# EAGLE design proudomodul3 (EAGLE 7.2.0)

## Sheet 1 of 4: Power supply
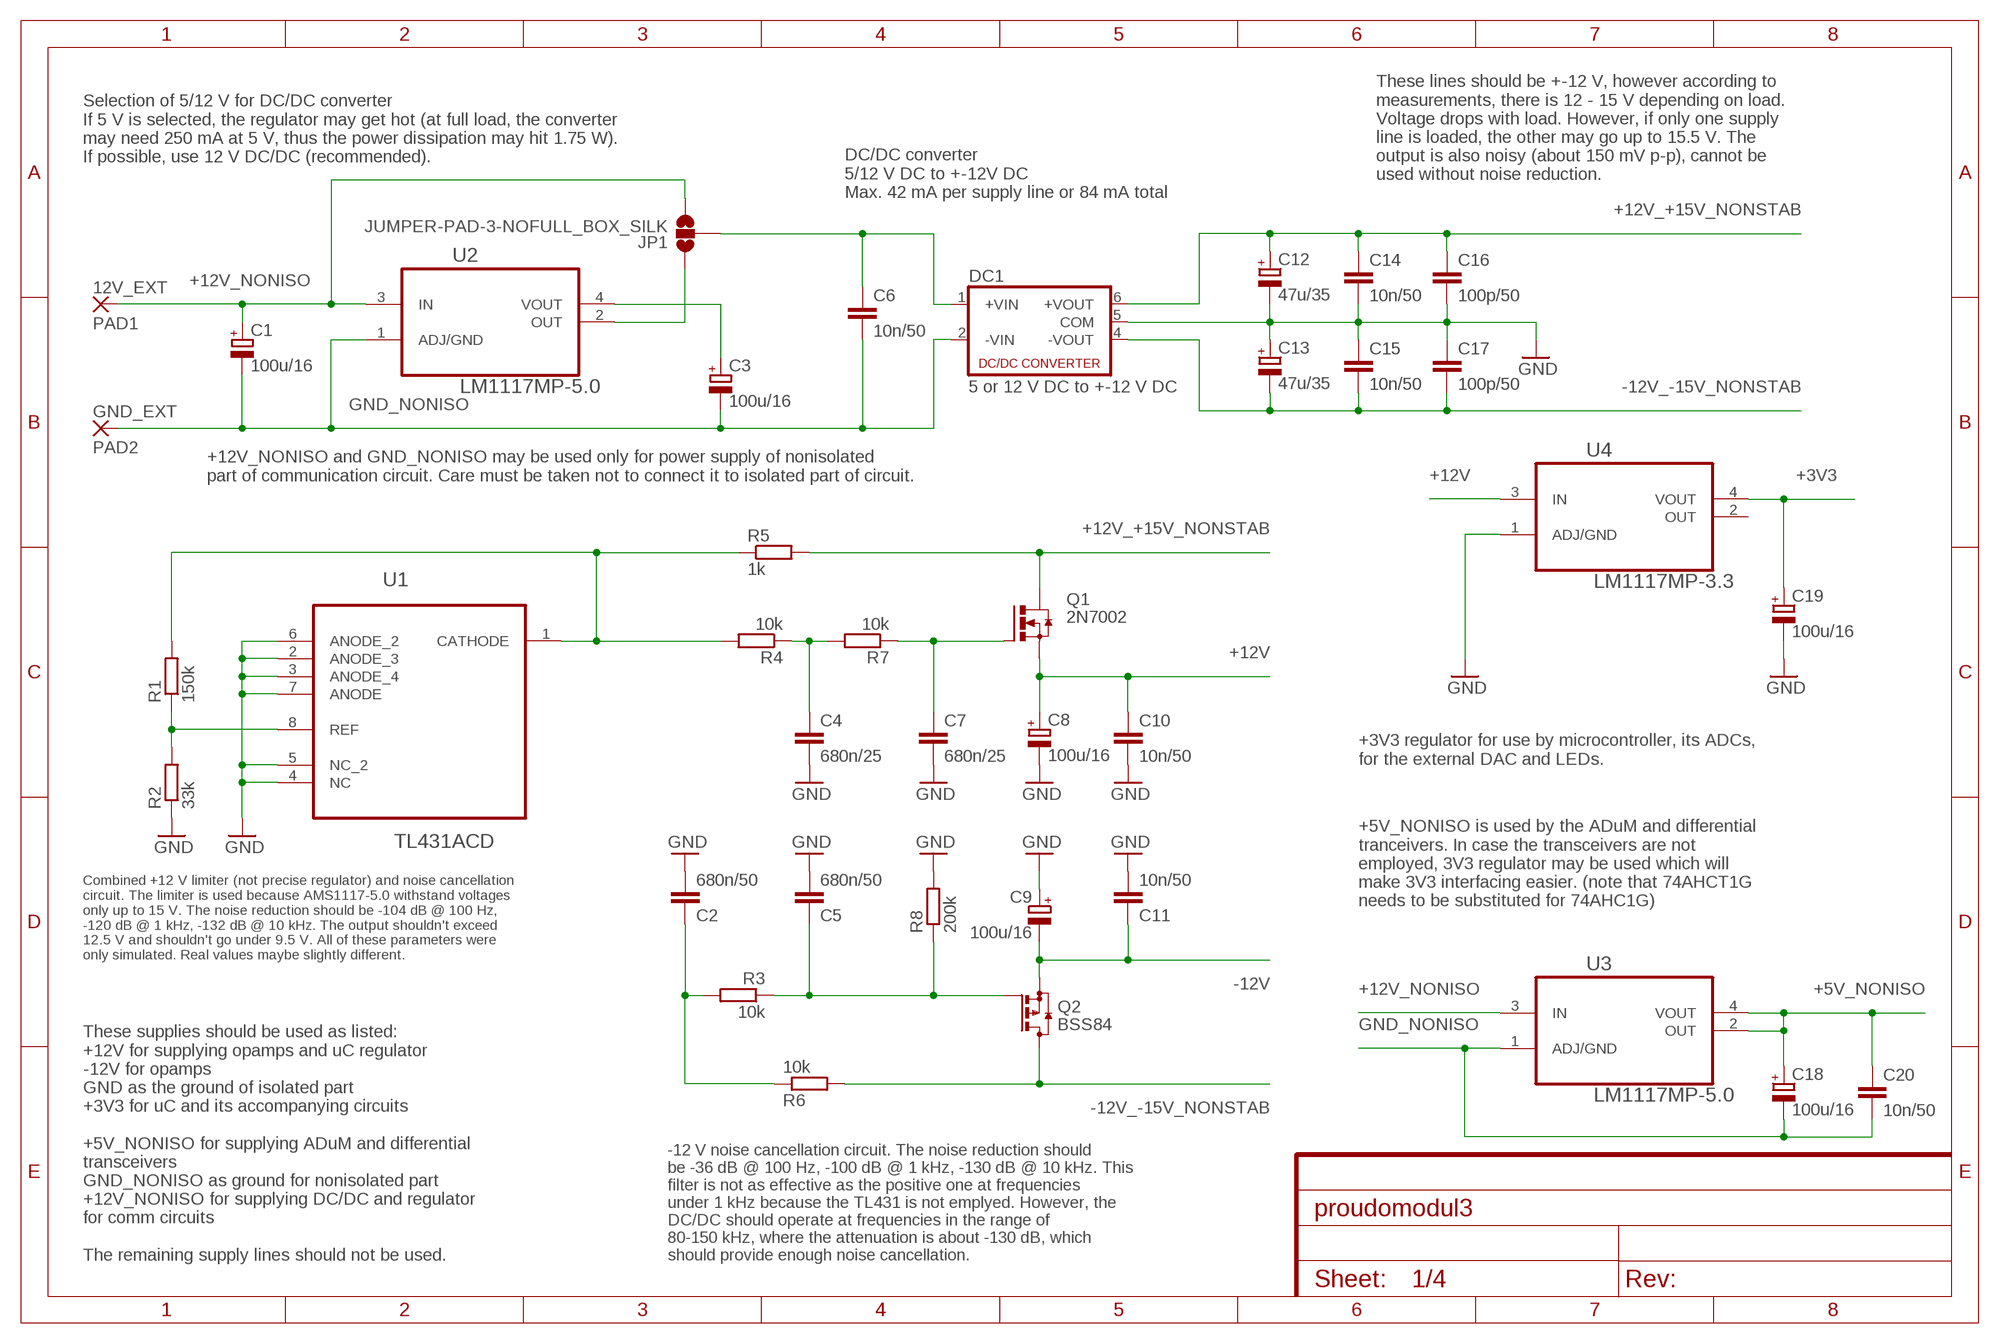
[diagram p0: schematic, sheet 1]
FRAME1 (FRAME-A4L): CNAME: Power supply; CREVISION: 107; DESIGNER: Petr Polasek

### Parts
C1  100u/16  CPOL-EU153CLV-0605  [153CLV-0605]
C2  680n/50  C-EUC0805  [C0805]
C3  100u/16  CPOL-EU153CLV-0605  [153CLV-0605]
C4  680n/25  C-EUC0805  [C0805]
C5  680n/50  C-EUC0805  [C0805]
C6  10n/50  C-EUC0805  [C0805]
C7  680n/25  C-EUC0805  [C0805]
C8  100u/16  CPOL-EU153CLV-0605  [153CLV-0605]
C9  100u/16  CPOL-EU153CLV-0605  [153CLV-0605]
C10  10n/50  C-EUC0805  [C0805]
C11  10n/50  C-EUC0805  [C0805]
C12  47u/35  CPOL-EU153CLV-0605  [153CLV-0605]
C13  47u/35  CPOL-EU153CLV-0605  [153CLV-0605]
C14  10n/50  C-EUC0805  [C0805]
C15  10n/50  C-EUC0805  [C0805]
C16  100p/50  C-EUC0805  [C0805]
C17  100p/50  C-EUC0805  [C0805]
C18  100u/16  CPOL-EU153CLV-0605  [153CLV-0605]
C19  100u/16  CPOL-EU153CLV-0605  [153CLV-0605]
C20  10n/50  C-EUC0805  [C0805]
DC1  5 or 12 V DC to +-12 V DC  NMA  [NMA]
JP1  JUMPER-PAD-3-NOFULL_BOX_SILK  [PAD-JUMPER-3-NO_YES_SILK_FULL_BOX]
PAD1  12V_EXT  2,15/1,0  [2,15/1,0]
PAD2  GND_EXT  2,15/1,0  [2,15/1,0]
Q1  2N7002  [SOT23-BEC]
Q2  BSS84  [SOT23]
R1  150k  R-EU_R0805  [R0805]
R2  33k  R-EU_R0805  [R0805]
R3  10k  R-EU_R0805  [R0805]
R4  10k  R-EU_R0805  [R0805]
R5  1k  R-EU_R0805  [R0805]
R6  10k  R-EU_R0805  [R0805]
R7  10k  R-EU_R0805  [R0805]
R8  200k  R-EU_R0805  [R0805]
U1  TL431ACD  [SOIC127P600X175-8N]
U2  LM1117MP-5.0  [SOT230P696X180-4N]
U3  LM1117MP-5.0  [SOT230P696X180-4N]
U4  LM1117MP-3.3  [SOT230P696X180-4N]

### Nets
+3V3: C19.+ U4.4(VOUT) ; also sheet 2,4
+5V_NONISO: C18.+ C20.1 U3.2(OUT) U3.4(VOUT) ; also sheet 2
+12V: C8.+ C10.1 Q1.E(S) U4.3(IN) ; also sheet 3,4
+12V_+15V_NONSTAB: C12.+ C14.1 C16.1 DC1.6(+VOUT) Q1.C(D) R5.2
+12V_NONISO: C1.+ JP1.3 PAD1.1(P) U2.3(IN) U3.3(IN) ; also sheet 2
-12V: C9.- C11.1 Q2.2(S) ; also sheet 3,4
-12V_-15V_NONSTAB: C13.- C15.2 C17.2 DC1.4(-VOUT) Q2.3(D) R6.2
GND: C2.2 C4.2 C5.2 C7.2 C8.- C9.+ C10.2 C11.2 C12.- C13.+ C14.2 C15.1 C16.2 C17.1 C19.- DC1.5(COM) R2.1 R8.2 U1.2(ANODE_3) U1.3(ANODE_4) U1.4(NC) U1.5(NC_2) U1.6(ANODE_2) U1.7(ANODE) U4.1(ADJ/GND) ; also sheet 2,3,4
GND_NONISO: C1.- C3.- C6.2 C18.- C20.2 DC1.2(-VIN) PAD2.1(P) U2.1(ADJ/GND) U3.1(ADJ/GND) ; also sheet 2
N$21: C4.1 R4.1 R7.2
N$26: C6.1 DC1.1(+VIN) JP1.2
N$27: R1.1 R2.2 U1.8(REF)
N$28: R1.2 R4.2 R5.1 U1.1(CATHODE)
N$29: C7.1 Q1.B(G) R7.1
N$30: C2.1 R3.2 R6.1
N$31: C5.1 Q2.1(G) R3.1 R8.1
N$45: JP1.1 U2.2(OUT)
N$47: C3.+ U2.4(VOUT)
Unconnected: U4.2(OUT)

### Notes on the sheet
- Selection of 5/12 V for DC/DC converter
  If 5 V is selected, the regulator may get hot (at full load, the converter
  may need 250 mA at 5 V, thus the power dissipation may hit 1.75 W).
  If possible, use 12 V DC/DC (recommended).
- These lines should be +-12 V, however according to
  measurements, there is 12 - 15 V depending on load.
  Voltage drops with load. However, if only one supply
  line is loaded, the other may go up to 15.5 V. The
  output is also noisy (about 150 mV p-p), cannot be
  used without noise reduction.
- DC/DC converter
  5/12 V DC to +-12V DC
  Max. 42 mA per supply line or 84 mA total
- +12V_NONISO and GND_NONISO may be used only for power supply of nonisolated
  part of communication circuit. Care must be taken not to connect it to isolated part of circuit.
- +3V3 regulator for use by microcontroller, its ADCs,
  for the external DAC and LEDs.
- +5V_NONISO is used by the ADuM and differential
  tranceivers. In case the transceivers are not
  employed, 3V3 regulator may be used which will
  make 3V3 interfacing easier. (note that 74AHCT1G
  needs to be substituted for 74AHC1G)
- Combined +12 V limiter (not precise regulator) and noise cancellation
  circuit. The limiter is used because AMS1117-5.0 withstand voltages
  only up to 15 V. The noise reduction should be -104 dB @ 100 Hz, 
  -120 dB @ 1 kHz, -132 dB @ 10 kHz. The output shouldn't exceed
  12.5 V and shouldn't go under 9.5 V. All of these parameters were
  only simulated. Real values maybe slightly different.
- These supplies should be used as listed:
  +12V for supplying opamps and uC regulator
  -12V for opamps
  GND as the ground of isolated part
  +3V3 for uC and its accompanying circuits
  
  +5V_NONISO for supplying ADuM and differential
  transceivers
  GND_NONISO as ground for nonisolated part
  +12V_NONISO for supplying DC/DC and regulator
  for comm circuits
  
  The remaining supply lines should not be used.
- -12 V noise cancellation circuit. The noise reduction should
  be -36 dB @ 100 Hz, -100 dB @ 1 kHz, -130 dB @ 10 kHz. This
  filter is not as effective as the positive one at frequencies
  under 1 kHz because the TL431 is not emplyed. However, the
  DC/DC should operate at frequencies in the range of
  80-150 kHz, where the attenuation is about -130 dB, which
  should provide enough noise cancellation.

## Sheet 2 of 4: Isolated comm circuits
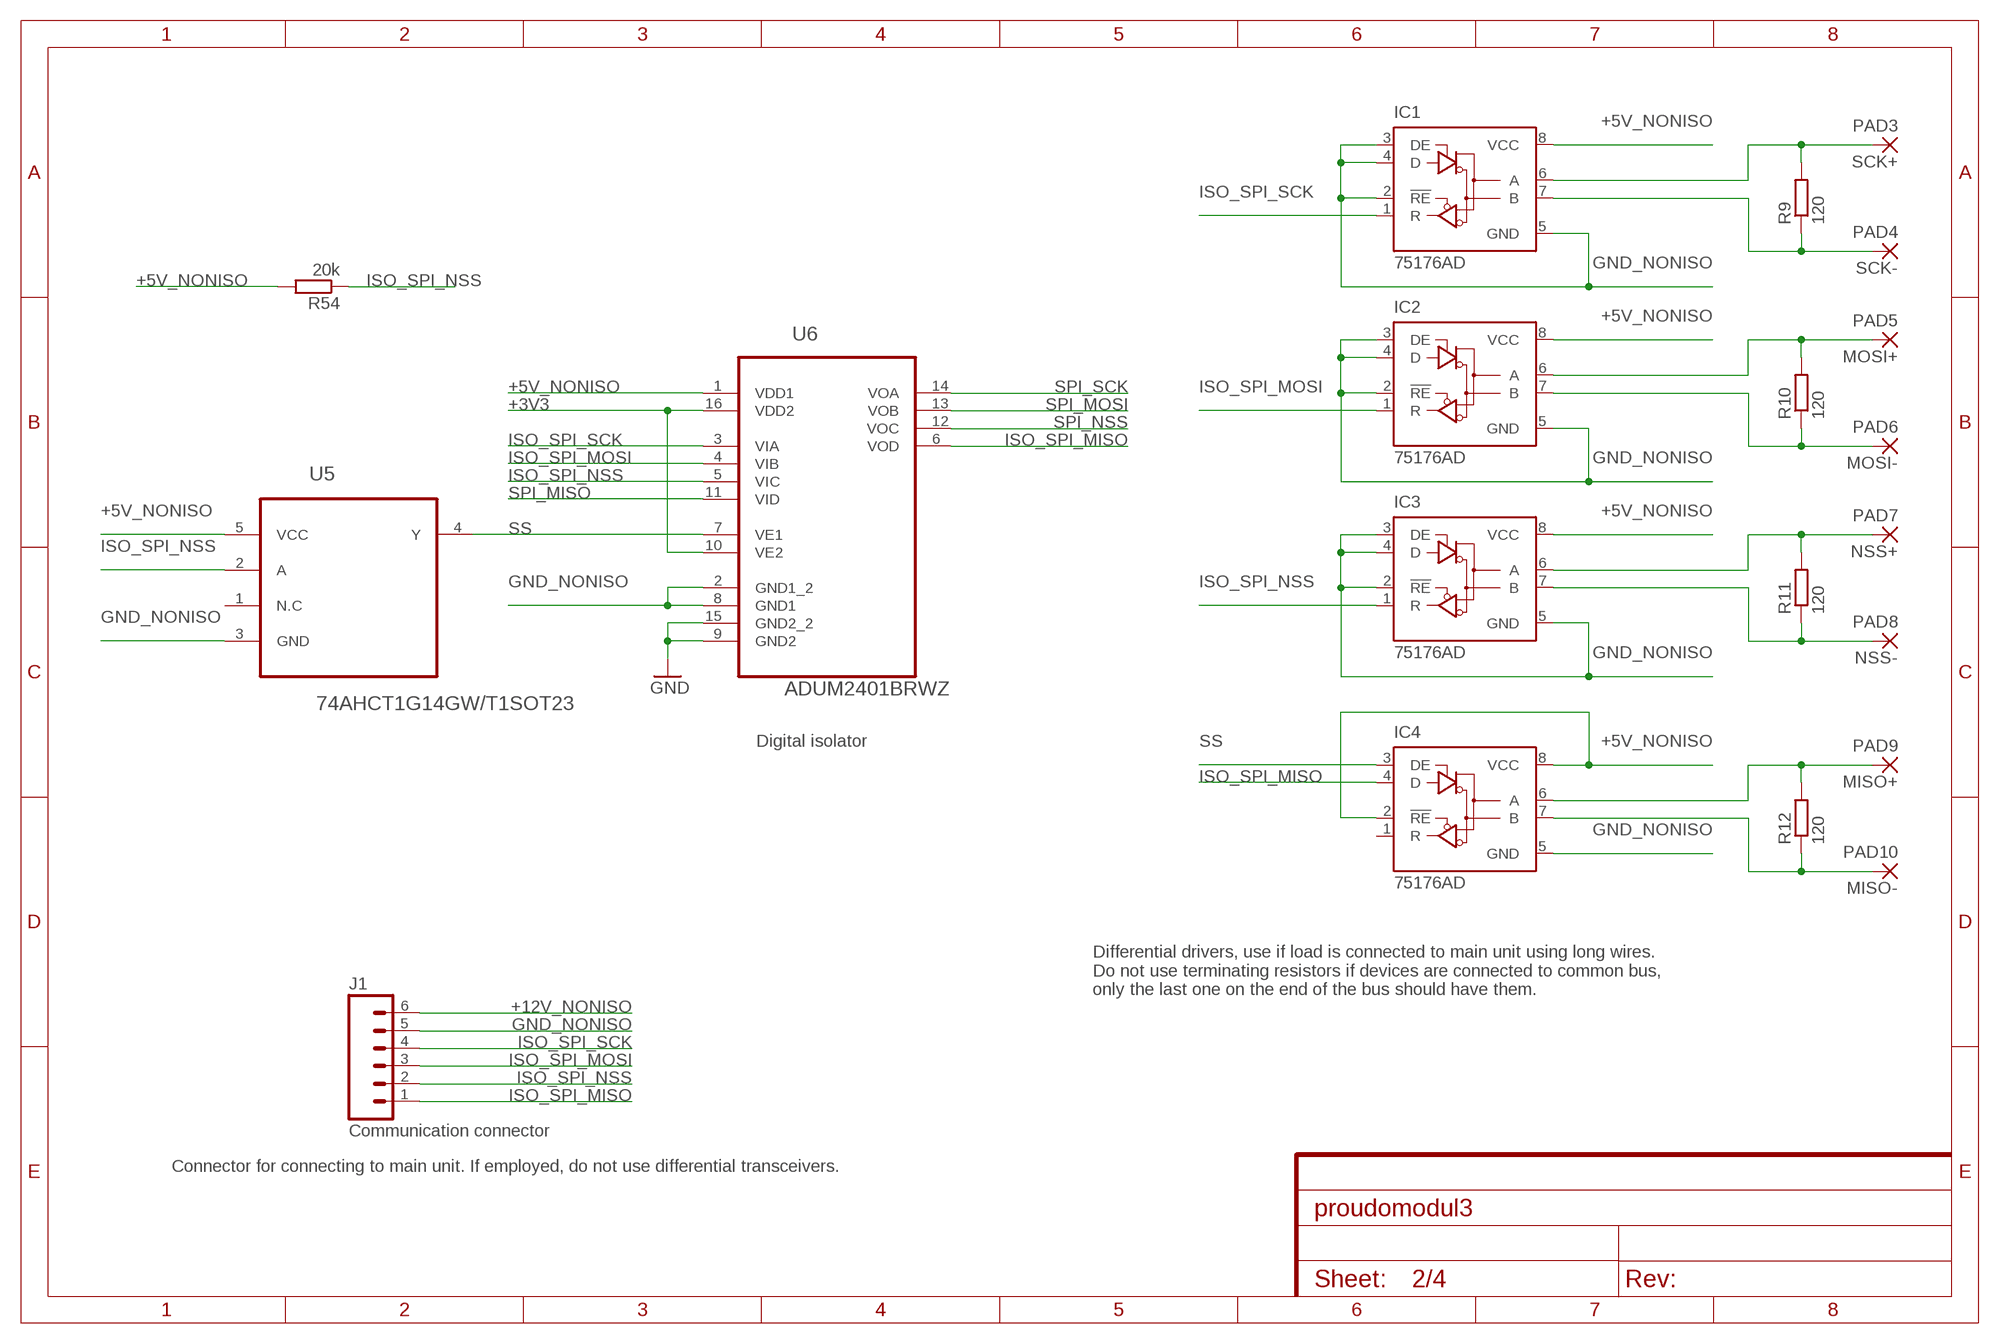
[diagram p1: schematic, sheet 2]
FRAME2 (FRAME-A4L): CNAME: Isolated comm circuits; CREVISION: 107; DESIGNER: Petr Polasek

### Parts
IC1  75176AD  [D_R-PDSO-G8]
IC2  75176AD  [D_R-PDSO-G8]
IC3  75176AD  [D_R-PDSO-G8]
IC4  75176AD  [D_R-PDSO-G8]
J1  Communication connector  M06RA_LOCK  [MOLEX-1X6-RA_LOCK]
PAD3  SCK+  2,15/1,0  [2,15/1,0]
PAD4  SCK-  2,15/1,0  [2,15/1,0]
PAD5  MOSI+  2,15/1,0  [2,15/1,0]
PAD6  MOSI-  2,15/1,0  [2,15/1,0]
PAD7  NSS+  2,15/1,0  [2,15/1,0]
PAD8  NSS-  2,15/1,0  [2,15/1,0]
PAD9  MISO+  2,15/1,0  [2,15/1,0]
PAD10  MISO-  2,15/1,0  [2,15/1,0]
R9  120  R-EU_R0805  [R0805]
R10  120  R-EU_R0805  [R0805]
R11  120  R-EU_R0805  [R0805]
R12  120  R-EU_R0805  [R0805]
R54  20k  R-EU_R0805  [R0805]
U5  74AHCT1G14GW/T1SOT23  [SOT23-5L]
U6  ADUM2401BRWZ  [SOIC127P1032X265-16N]

### Nets
+3V3: U6.10(VE2) U6.16(VDD2) ; also sheet 1,4
+5V_NONISO: IC1.8(VCC) IC2.8(VCC) IC3.8(VCC) IC4.2(!RE) IC4.8(VCC) R54.2 U5.5(VCC) U6.1(VDD1) ; also sheet 1
+12V_NONISO: J1.6 ; also sheet 1
GND: U6.9(GND2) U6.15(GND2_2) ; also sheet 1,3,4
GND_NONISO: IC1.2(!RE) IC1.3(DE) IC1.4(D) IC1.5(GND) IC2.2(!RE) IC2.3(DE) IC2.4(D) IC2.5(GND) IC3.2(!RE) IC3.3(DE) IC3.4(D) IC3.5(GND) IC4.5(GND) J1.5 U5.3(GND) U6.2(GND1_2) U6.8(GND1) ; also sheet 1
ISO_SPI_MISO: IC4.4(D) J1.1 U6.6(VOD)
ISO_SPI_MOSI: IC2.1(R) J1.3 U6.4(VIB)
ISO_SPI_NSS: IC3.1(R) J1.2 R54.1 U5.2(A) U6.5(VIC)
ISO_SPI_SCK: IC1.1(R) J1.4 U6.3(VIA)
N$25: IC4.6(A) PAD9.1(P) R12.2
N$39: IC4.7(B) PAD10.1(P) R12.1
N$40: IC3.6(A) PAD7.1(P) R11.2
N$41: IC3.7(B) PAD8.1(P) R11.1
N$42: IC2.6(A) PAD5.1(P) R10.2
N$43: IC2.7(B) PAD6.1(P) R10.1
N$44: IC1.7(B) PAD4.1(P) R9.1
N$46: IC1.6(A) PAD3.1(P) R9.2
SPI_MISO: U6.11(VID) ; also sheet 4
SPI_MOSI: U6.13(VOB) ; also sheet 4
SPI_NSS: U6.12(VOC) ; also sheet 4
SPI_SCK: U6.14(VOA) ; also sheet 4
SS: IC4.3(DE) U5.4(Y) U6.7(VE1)
Unconnected: IC4.1(R) U5.1(N.C)

### Notes on the sheet
- Digital isolator
- Differential drivers, use if load is connected to main unit using long wires.
  Do not use terminating resistors if devices are connected to common bus,
  only the last one on the end of the bus should have them.
- Connector for connecting to main unit. If employed, do not use differential transceivers.

## Sheet 3 of 4: Regulator
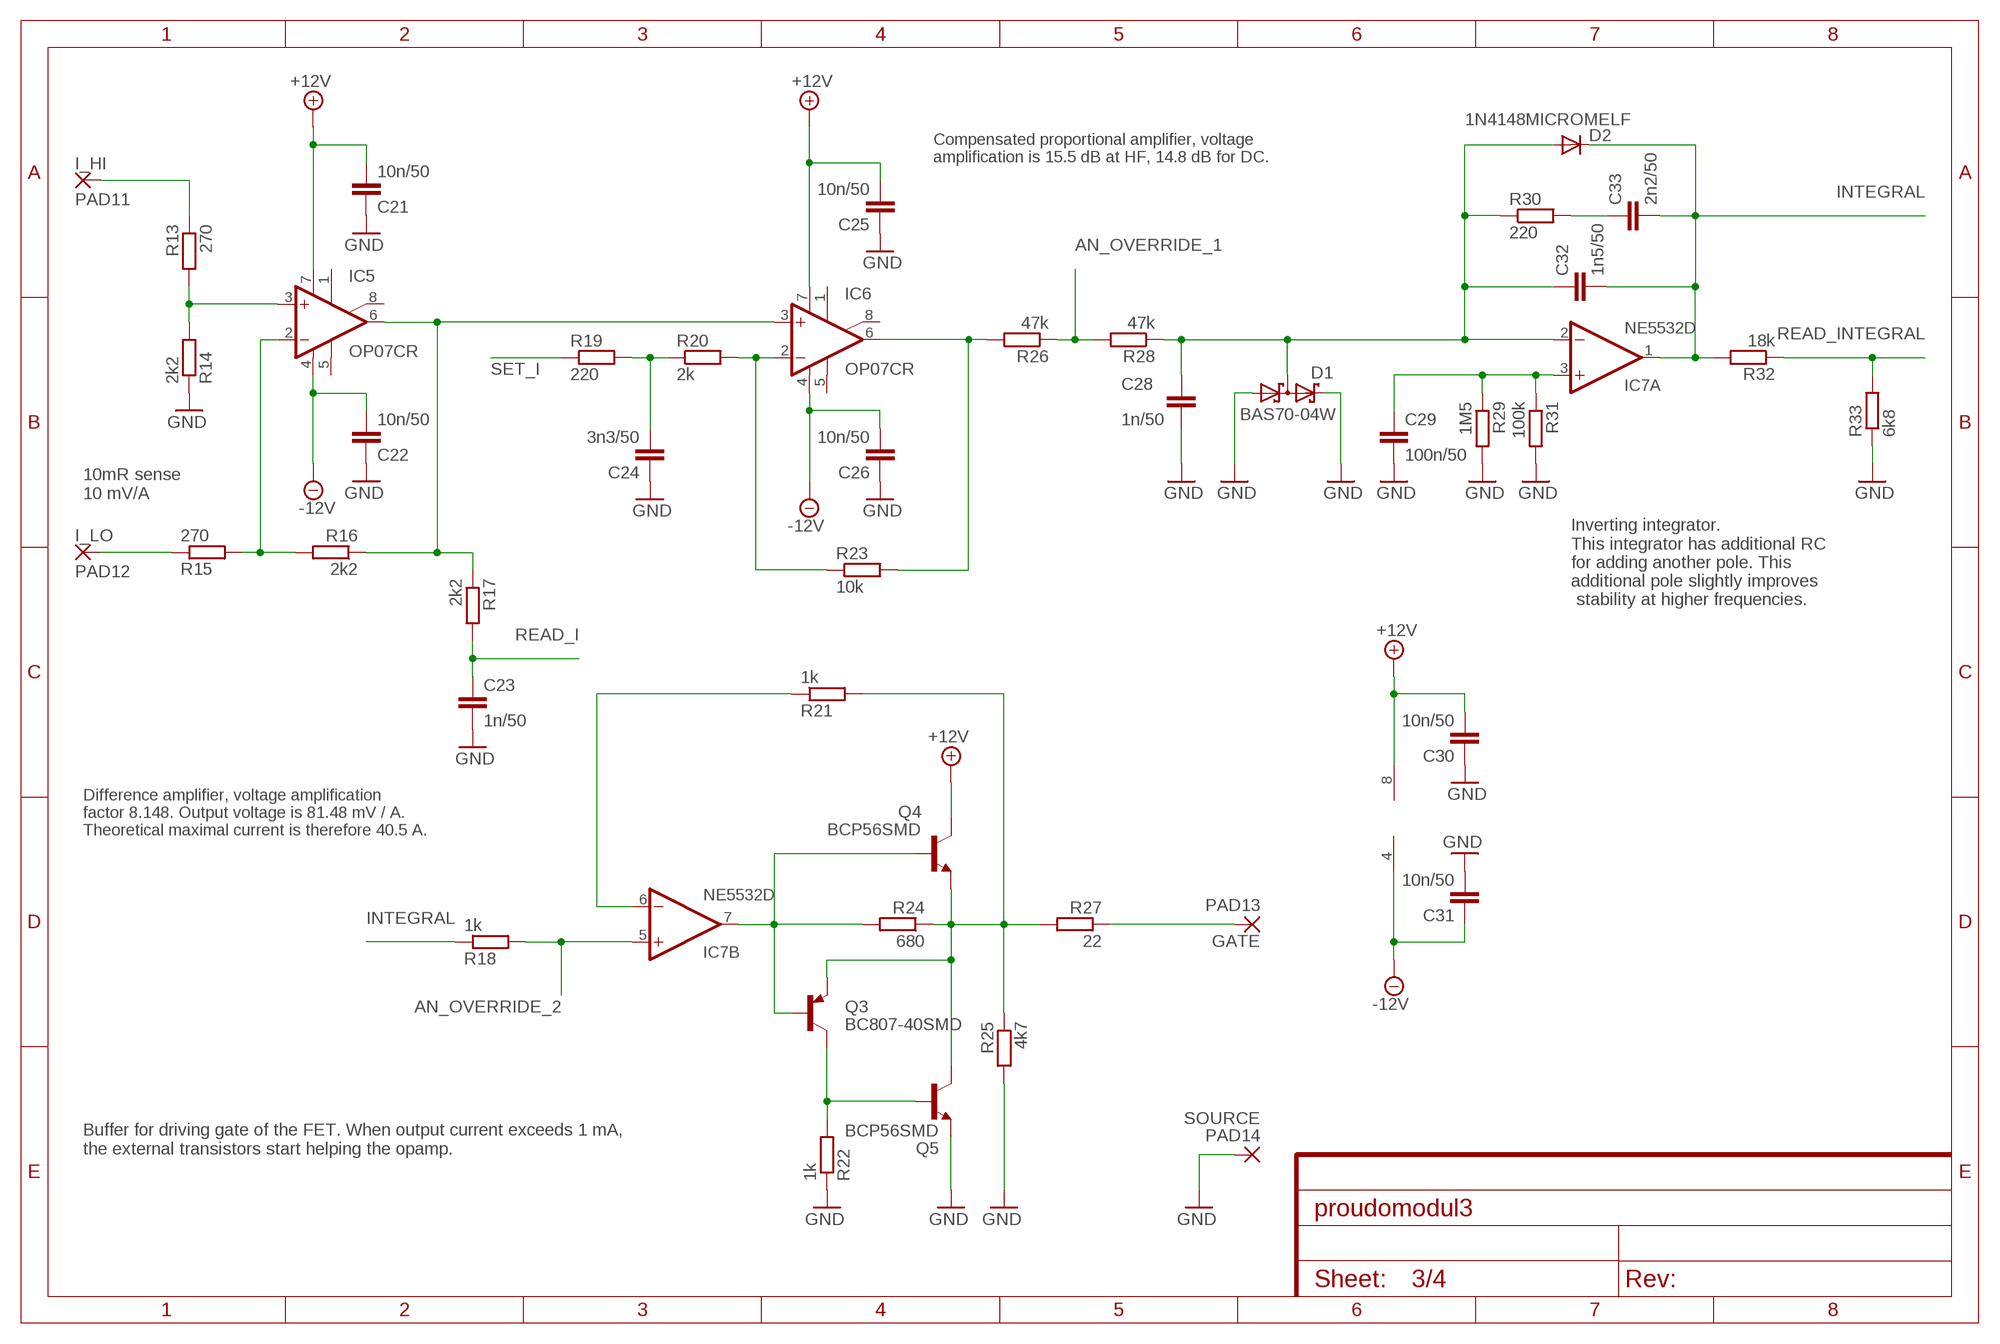
[diagram p2: schematic, sheet 3]
FRAME3 (FRAME-A4L): CNAME: Regulator; CREVISION: 107; DESIGNER: Petr Polasek

### Parts
C21  10n/50  C-EUC0805  [C0805]
C22  10n/50  C-EUC0805  [C0805]
C23  1n/50  C-EUC0805  [C0805]
C24  3n3/50  C-EUC0805  [C0805]
C25  10n/50  C-EUC0805  [C0805]
C26  10n/50  C-EUC0805  [C0805]
C28  1n/50  C-EUC0805  [C0805]
C29  100n/50  C-EUC0805  [C0805]
C30  10n/50  C-EUC0805  [C0805]
C31  10n/50  C-EUC0805  [C0805]
C32  1n5/50  C-EUC0805  [C0805]
C33  2n2/50  C-EUC0805  [C0805]
D1  BAS70-04W  [SOT323]
D2  1N4148MICROMELF  [MICROMELF-W]
IC5  OP07CR  [SO08]
IC6  OP07CR  [SO08]
IC7  NE5532D  [SO08]
PAD11  I_HI  2,15/1,0  [2,15/1,0]
PAD12  I_LO  2,15/1,0  [2,15/1,0]
PAD13  GATE  2,15/1,0  [2,15/1,0]
PAD14  SOURCE  2,15/1,0  [2,15/1,0]
Q3  BC807-40SMD  [SOT23-BEC]
Q4  BCP56SMD  [SOT223]
Q5  BCP56SMD  [SOT223]
R13  270  R-EU_R0805  [R0805]
R14  2k2  R-EU_R0805  [R0805]
R15  270  R-EU_R0805  [R0805]
R16  2k2  R-EU_R0805  [R0805]
R17  2k2  R-EU_R0805  [R0805]
R18  1k  R-EU_R0805  [R0805]
R19  220  R-EU_R0805  [R0805]
R20  2k  R-EU_R0805  [R0805]
R21  1k  R-EU_R0805  [R0805]
R22  1k  R-EU_R0805  [R0805]
R23  10k  R-EU_R0805  [R0805]
R24  680  R-EU_R0805  [R0805]
R25  4k7  R-EU_R0805  [R0805]
R26  47k  R-EU_R0805  [R0805]
R27  22  R-EU_R0805  [R0805]
R28  47k  R-EU_R0805  [R0805]
R29  1M5  R-EU_R0805  [R0805]
R30  220  R-EU_R0805  [R0805]
R31  100k  R-EU_R0805  [R0805]
R32  18k  R-EU_R0805  [R0805]
R33  6k8  R-EU_R0805  [R0805]

### Nets
+12V: C21.2 C25.2 C30.2 IC5.7(V+) IC6.7(V+) IC7.8(P:V+) Q4.2(C) Q4.4(C) ; also sheet 1,4
-12V: C22.2 C26.2 C31.1 IC5.4(V-) IC6.4(V-) IC7.4(P:V-) ; also sheet 1,4
AN_OVERRIDE_1: R26.1 R28.2 ; also sheet 4
AN_OVERRIDE_2: IC7.5(B:+IN) R18.2 ; also sheet 4
GND: C21.1 C22.1 C23.2 C24.1 C25.1 C26.1 C28.2 C29.2 C30.1 C31.2 D1.1(A1) D1.2(C2) PAD14.1(P) Q5.3(E) R14.1 R22.1 R25.2 R29.2 R31.2 R33.1 ; also sheet 1,2,4
INTEGRAL: C32.2 C33.2 D2.C IC7.1(A:OUT) R18.1 R32.2
N$2: C33.1 R30.2
N$3: PAD11.1(P) R13.1
N$5: PAD13.1(P) R27.1
N$6: Q3.E Q4.3(E) Q5.2(C) Q5.4(C) R21.2 R24.1 R25.1 R27.2
N$8: IC7.7(B:OUT) Q3.B Q4.1(B) R24.2
N$10: IC5.3(+IN) R13.2 R14.2
N$11: PAD12.1(P) R15.1
N$12: IC5.2(-IN) R15.2 R16.2
N$14: C28.1 C32.1 D1.3(C1A2) D2.A IC7.2(A:-IN) R28.1 R30.1
N$15: C29.1 IC7.3(A:+IN) R29.1 R31.1
N$16: IC6.6(OUT) R23.2 R26.2
N$17: Q3.C Q5.1(B) R22.2
N$18: IC7.6(B:-IN) R21.1
N$19: IC6.2(-IN) R20.2 R23.1
N$73: IC5.6(OUT) IC6.3(+IN) R16.1 R17.1
N$75: C24.2 R19.2 R20.1
READ_I: C23.1 R17.2 ; also sheet 4
READ_INTEGRAL: R32.1 R33.2 ; also sheet 4
SET_I: R19.1 ; also sheet 4
Unconnected: IC5.1(ON1) IC5.5(OPT) IC5.8(ON2) IC6.1(ON1) IC6.5(OPT) IC6.8(ON2)

### Notes on the sheet
- Compensated proportional amplifier, voltage
  amplification is 15.5 dB at HF, 14.8 dB for DC.
- 10mR sense
  10 mV/A
- Inverting integrator.
  This integrator has additional RC
  for adding another pole. This
  additional pole slightly improves
   stability at higher frequencies.
- Difference amplifier, voltage amplification
  factor 8.148. Output voltage is 81.48 mV / A.
  Theoretical maximal current is therefore 40.5 A.
- Buffer for driving gate of the FET. When output current exceeds 1 mA,
  the external transistors start helping the opamp.

## Sheet 4 of 4: Controller
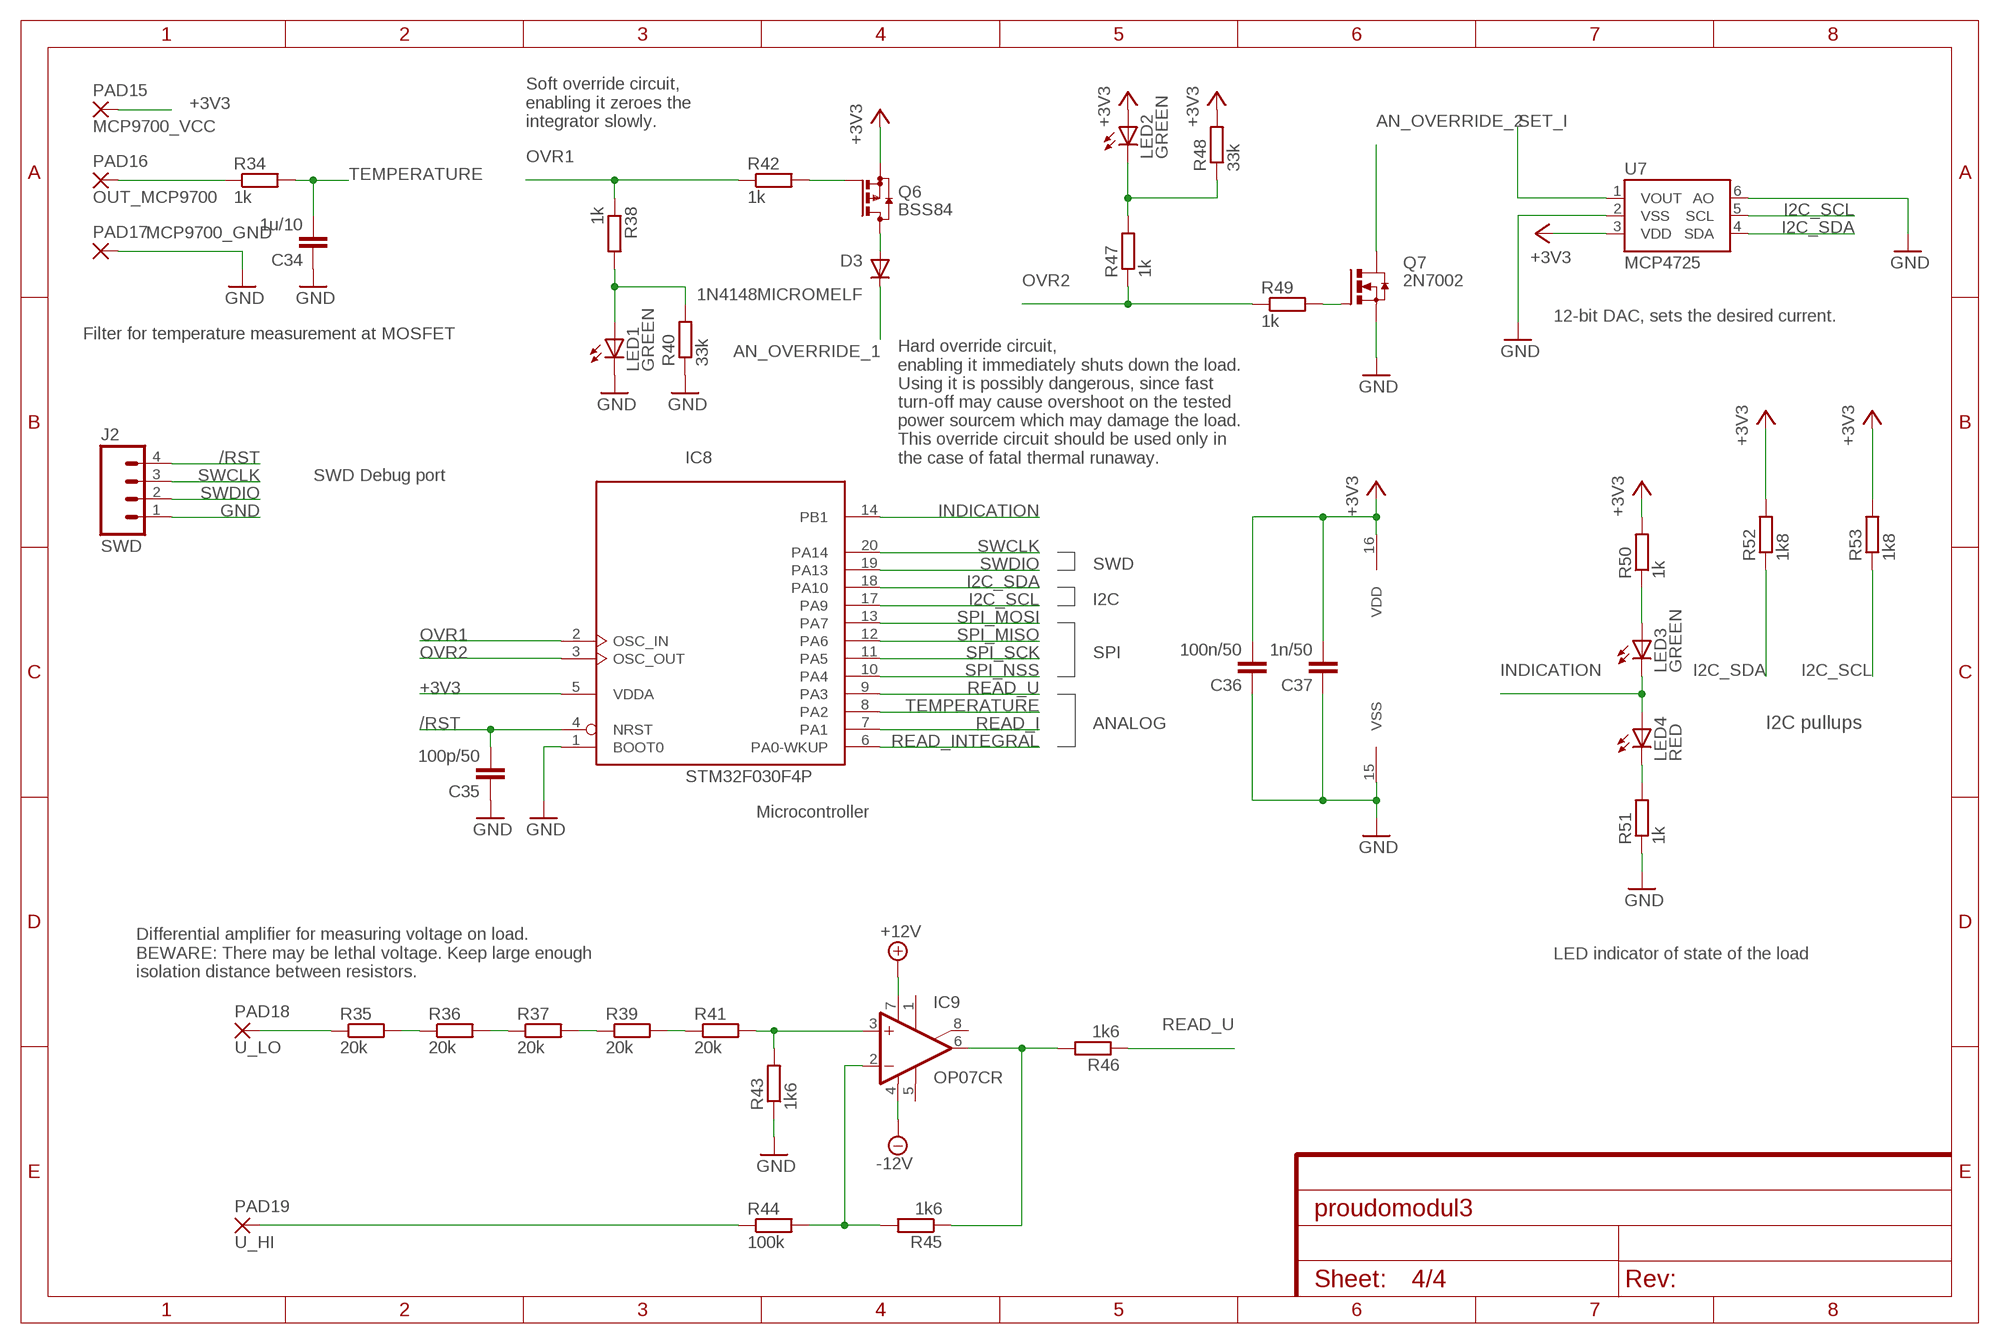
[diagram p3: schematic, sheet 4]
FRAME4 (FRAME-A4L): CNAME: Controller; CREVISION: 107; DESIGNER: Petr Polasek

### Parts
C34  1u/10  C-EUC0805  [C0805]
C35  100p/50  C-EUC0805  [C0805]
C36  100n/50  C-EUC0805  [C0805]
C37  1n/50  C-EUC0805  [C0805]
D3  1N4148MICROMELF  [MICROMELF-W]
IC8  STM32F030F4P  [TSSOP20-I]
IC9  OP07CR  [SO08]
J2  SWD  M04SMD_STRAIGHT_COMBO  [1X04_SMD_STRAIGHT_COMBO]
LED1  GREEN  LEDSML0603  [SML0603]
LED2  GREEN  LEDSML0603  [SML0603]
LED3  GREEN  LEDSML0603  [SML0603]
LED4  RED  LEDSML0603  [SML0603]
PAD15  MCP9700_VCC  2,15/1,0  [2,15/1,0]
PAD16  OUT_MCP9700  2,15/1,0  [2,15/1,0]
PAD17  MCP9700_GND  2,15/1,0  [2,15/1,0]
PAD18  U_LO  2,15/1,0  [2,15/1,0]
PAD19  U_HI  2,15/1,0  [2,15/1,0]
Q6  BSS84  [SOT23]
Q7  2N7002  [SOT23-BEC]
R34  1k  R-EU_R0805  [R0805]
R35  20k  R-EU_R0805  [R0805]
R36  20k  R-EU_R0805  [R0805]
R37  20k  R-EU_R0805  [R0805]
R38  1k  R-EU_R0805  [R0805]
R39  20k  R-EU_R0805  [R0805]
R40  33k  R-EU_R0805  [R0805]
R41  20k  R-EU_R0805  [R0805]
R42  1k  R-EU_R0805  [R0805]
R43  1k6  R-EU_R0805  [R0805]
R44  100k  R-EU_R0805  [R0805]
R45  1k6  R-EU_R0805  [R0805]
R46  1k6  R-EU_R0805  [R0805]
R47  1k  R-EU_R0805  [R0805]
R48  33k  R-EU_R0805  [R0805]
R49  1k  R-EU_R0805  [R0805]
R50  1k  R-EU_R0805  [R0805]
R51  1k  R-EU_R0805  [R0805]
R52  1k8  R-EU_R0805  [R0805]
R53  1k8  R-EU_R0805  [R0805]
U7  MCP4725  MCP4725SOT-23  [SOT23-6]

### Nets
+3V3: C36.2 C37.2 IC8.5(VDDA) IC8.16(VDD) LED2.A PAD15.1(P) Q6.2(S) R48.2 R50.2 R52.2 R53.2 U7.3(VDD) ; also sheet 1,2
+12V: IC9.7(V+) ; also sheet 1,3
-12V: IC9.4(V-) ; also sheet 1,3
/RST: C35.2 IC8.4(NRST) J2.4
AN_OVERRIDE_1: D3.C ; also sheet 3
AN_OVERRIDE_2: Q7.C(D) ; also sheet 3
GND: C34.1 C35.1 C36.1 C37.1 IC8.1(BOOT0) IC8.15(VSS) J2.1 LED1.C PAD17.1(P) Q7.E(S) R40.1 R43.1 R51.1 U7.2(VSS) U7.6(AO) ; also sheet 1,2,3
I2C_SCL: IC8.17(PA9) R53.1 U7.5(SCL)
I2C_SDA: IC8.18(PA10) R52.1 U7.4(SDA)
INDICATION: IC8.14(PB1) LED3.C LED4.A
N$1: LED1.A R38.2 R40.2
N$4: Q6.1(G) R42.2
N$7: Q7.B(G) R49.2
N$9: D3.A Q6.3(D)
N$13: LED2.C R47.2 R48.1
N$20: PAD16.1(P) R34.1
N$22: IC9.3(+IN) R41.2 R43.2
N$23: LED3.A R50.1
N$24: IC9.2(-IN) R44.2 R45.2
N$32: IC9.6(OUT) R45.1 R46.2
N$33: R39.2 R41.1
N$34: R37.2 R39.1
N$35: R36.2 R37.1
N$36: R35.2 R36.1
N$37: PAD19.1(P) R44.1
N$38: PAD18.1(P) R35.1
N$48: LED4.C R51.2
OVR1: IC8.2(OSC_IN) R38.1 R42.1
OVR2: IC8.3(OSC_OUT) R47.1 R49.1
READ_I: IC8.7(PA1) ; also sheet 3
READ_INTEGRAL: IC8.6(PA0-WKUP) ; also sheet 3
READ_U: IC8.9(PA3) R46.1
SET_I: U7.1(VOUT) ; also sheet 3
SPI_MISO: IC8.12(PA6) ; also sheet 2
SPI_MOSI: IC8.13(PA7) ; also sheet 2
SPI_NSS: IC8.10(PA4) ; also sheet 2
SPI_SCK: IC8.11(PA5) ; also sheet 2
SWCLK: IC8.20(PA14) J2.3
SWDIO: IC8.19(PA13) J2.2
TEMPERATURE: C34.2 IC8.8(PA2) R34.2
Unconnected: IC9.1(ON1) IC9.5(OPT) IC9.8(ON2)

### Notes on the sheet
- Soft override circuit,
  enabling it zeroes the
  integrator slowly.
- 12-bit DAC, sets the desired current.
- Filter for temperature measurement at MOSFET
- Hard override circuit,
  enabling it immediately shuts down the load.
  Using it is possibly dangerous, since fast
  turn-off may cause overshoot on the tested
  power sourcem which may damage the load.
  This override circuit should be used only in
  the case of fatal thermal runaway.
- SWD Debug port
- SWD
- I2C
- SPI
- ANALOG | I2C pullups
- Microcontroller
- LED indicator of state of the load
- Differential amplifier for measuring voltage on load.
  BEWARE: There may be lethal voltage. Keep large enough
  isolation distance between resistors.

## Library data of the parts
C1 C3 C8 C9 C12 C13 C18 C19 = petr:CPOL-EU: POLARIZED CAPACITOR, European symbol
C2 C4-C7 C10 C11 C14-C17 C20-C26 C28-C37 = petr:C-EU: CAPACITOR, European symbol
D1 = petr:BAS70-04: Silicon Schottky Diodes General-purpose diode for high-speed switching
D2 D3 = petr:1N4148: DIODE high speed (Philips)
DC1 = dc-dc-converter:NMA: DC-DC CONVERTER; MF: C & D TECHNOLOGIES, INC; MPN: NMA0515SC; OC_FARNELL: 1021434; OC_NEWARK: 61K3064
IC1-IC4 = 751xx:75176A: DIFFERENTIAL BUS TRANSCEIVER Source: http://focus.ti.com/lit/ds/symlink/sn75176a.pdf
IC5 IC6 = linear:OP07*: OP AMP
IC7 = petr:NE5532: AUDIO AMPLIFIER
IC8 = micro-stm:STM32F030F*P: ARM 32-bit Cortex™-M0 CPU 48 MHz maximum frequency 16 Kbytes of Flash memory 4 kbytes of SRAM 15 GPIOs 2.4 to 3.6 V application supply
IC9 = petr:OP07*: OP AMP
J1 = SparkFun-Connectors:M06: Header 6 Standard 6-pin 0.1" header. Use with straight break away headers (SKU : PRT-00116), right angle break away headers (PRT-00553), swiss pins (PRT-00743), machine pins (PRT-00117), and female headers (PRT-00115). Molex polarized connector foot print use with SKU : PRT-08094 with associated crimp pins and housings. NOTES ON THE VARIANTS LOCK and LOCK_LONGPADS... This footprint was designed to help hold the alignment of a through-hole component (i.e. 6-pin header) while soldering it into place. You may notice that each hole has been shifted either up or down by 0.005 of an inch from it's more standard position (which is a perfectly straight line). This slight alteration caused the pins (the squares in the middle) to touch the edges of the holes. Because they are alternating, it causes a "brace" to hold the component in place. 0.005 has proven to be the perfect amount of "off-center" position when using our standard breakaway headers. Although looks a little odd when you look at the bare footprint, once you have a header in there, the alteration is very hard to notice. Also,if you push a header all the way into place, it is covered up entirely on the bottom side. This idea of altering the position of holes to aid alignment will be further integrated into the Sparkfun Library for other footprints. It can help hold any component with 3 or more connection pins.
J2 = petr:M04: Header 4 Standard 4-pin 0.1" header. Use with straight break away headers (SKU : PRT-00116), right angle break away headers (PRT-00553), swiss pins (PRT-00743), machine pins (PRT-00117), and female headers (PRT-00115). Molex polarized connector foot print use with SKU : PRT-08231 with associated crimp pins and housings. 1MM SMD Version SKU: PRT-10208; PROD_ID: CONN-08511; VALUE: 1X04_SMD_STRAIGHT_COMBO
JP1 = SparkFun-Passives:JUMPER-PAD-3-NO
LED1-LED4 = led:LED: LED OSRAM: - CHIPLED LG R971, LG N971, LY N971, LG Q971, LY Q971, LO R971, LY R971 LH N974, LH R974 LS Q976, LO Q976, LY Q976 LO Q996 - Hyper CHIPLED LW Q18S LB Q993, LB Q99A, LB R99A - SideLED LS A670, LO A670, LY A670, LG A670, LP A670 LB A673, LV A673, LT A673, LW A673 LH A674 LY A675 LS A676, LA A676, LO A676, LY A676, LW A676 LS A679, LY A679, LG A679 - Hyper Micro SIDELED® LS Y876, LA Y876, LO Y876, LY Y876 LT Y87S - SmartLED LW L88C, LW L88S LB L89C, LB L89S, LG L890 LS L89K, LO L89K, LY L89K LS L896, LA L896, LO L896, LY L896 - TOPLED LS T670, LO T670, LY T670, LG T670, LP T670 LSG T670, LSP T670, LSY T670, LOP T670, LYG T670 LG T671, LOG T671, LSG T671 LB T673, LV T673, LT T673, LW T673 LH T674 LS T676, LA T676, LO T676, LY T676, LB T676, LH T676, LSB T676, LW T676 LB T67C, LV T67C, LT T67C, LS T67K, LO T67K, LY T67K, LW E67C LS E67B, LA E67B, LO E67B, LY E67B, LB E67C, LV E67C, LT E67C LW T67C LS T679, LY T679, LG T679 LS T770, LO T770, LY T770, LG T770, LP T770 LB T773, LV T773, LT T773, LW T773 LH T774 LS E675, LA E675, LY E675, LS T675 LS T776, LA T776, LO T776, LY T776, LB T776 LHGB T686 LT T68C, LB T68C - Hyper Mini TOPLED® LB M676 - Mini TOPLED Santana® LG M470 LS M47K, LO M47K, LY M47K Source: http://www.osram.convergy.de LUXEON: - LUMILED® LXK2-PW12-R00, LXK2-PW12-S00, LXK2-PW14-U00, LXK2-PW14-V00 LXK2-PM12-R00, LXK2-PM12-S00, LXK2-PM14-U00 LXK2-PE12-Q00, LXK2-PE12-R00, LXK2-PE12-S00, LXK2-PE14-T00, LXK2-PE14-U00 LXK2-PB12-K00, LXK2-PB12-L00, LXK2-PB12-M00, LXK2-PB14-N00, LXK2-PB14-P00, LXK2-PB14-Q00 LXK2-PR12-L00, LXK2-PR12-M00, LXK2-PR14-Q00, LXK2-PR14-R00 LXK2-PD12-Q00, LXK2-PD12-R00, LXK2-PD12-S00 LXK2-PH12-R00, LXK2-PH12-S00 LXK2-PL12-P00, LXK2-PL12-Q00, LXK2-PL12-R00 Source: www.luxeon.com KINGBRIGHT: KA-3528ASYC Source: www.kingbright.com
PAD1-PAD19 = wirepad:2,15/1,0: THROUGH-HOLE PAD
Q1 Q7 = petr:2N7002
Q2 Q6 = petr:BSS84: P-CHANNEL MOS FET
Q3 = petr:BC807*: PNP Transistror
Q4 Q5 = petr:BCP56: NPN
R1-R54 = petr:R-EU_: RESISTOR, European symbol
U1 = petr:TL431ACD: Programmable voltage reference; MPN: TL431ACD; OC_FARNELL: 1094357; OC_NEWARK: 89K1732; PACKAGE: SOIC-8; SUPPLIER: STMICROELECTRONICS
U2 U3 = NSC_By_element14_Batch_1.1:LM1117MP-5.0: Linear regulators; MPN: LM1117MP-5.0; OC_FARNELL: 9778209; OC_NEWARK: 41K3471; PACKAGE: SOT223-3; SUPPLIER: NationalSemiconductor
U4 = petr:LM1117MP-3.3: Linear regulators; MPN: LM1117MP-3.3; OC_FARNELL: 9778195; OC_NEWARK: 41K3470; PACKAGE: SOT223-3; SUPPLIER: NationalSemiconductor
U5 = petr:74AHCT1G14GW/T1: Inverting Schmitt trigger
U6 = petr:ADUM2401BRWZ: Quad-Channel Digital Isolators; MPN: ADUM2401BRWZ; OC_FARNELL: 1117110; OC_NEWARK: 19M8766; PACKAGE: SOIC-16; SUPPLIER: Analog Devices
U7 = SparkFun-AnalogIC:MCP4725: Microchip 12-bit I2C DAC, SOT23-6; PROD_ID: IC-08886

## Board
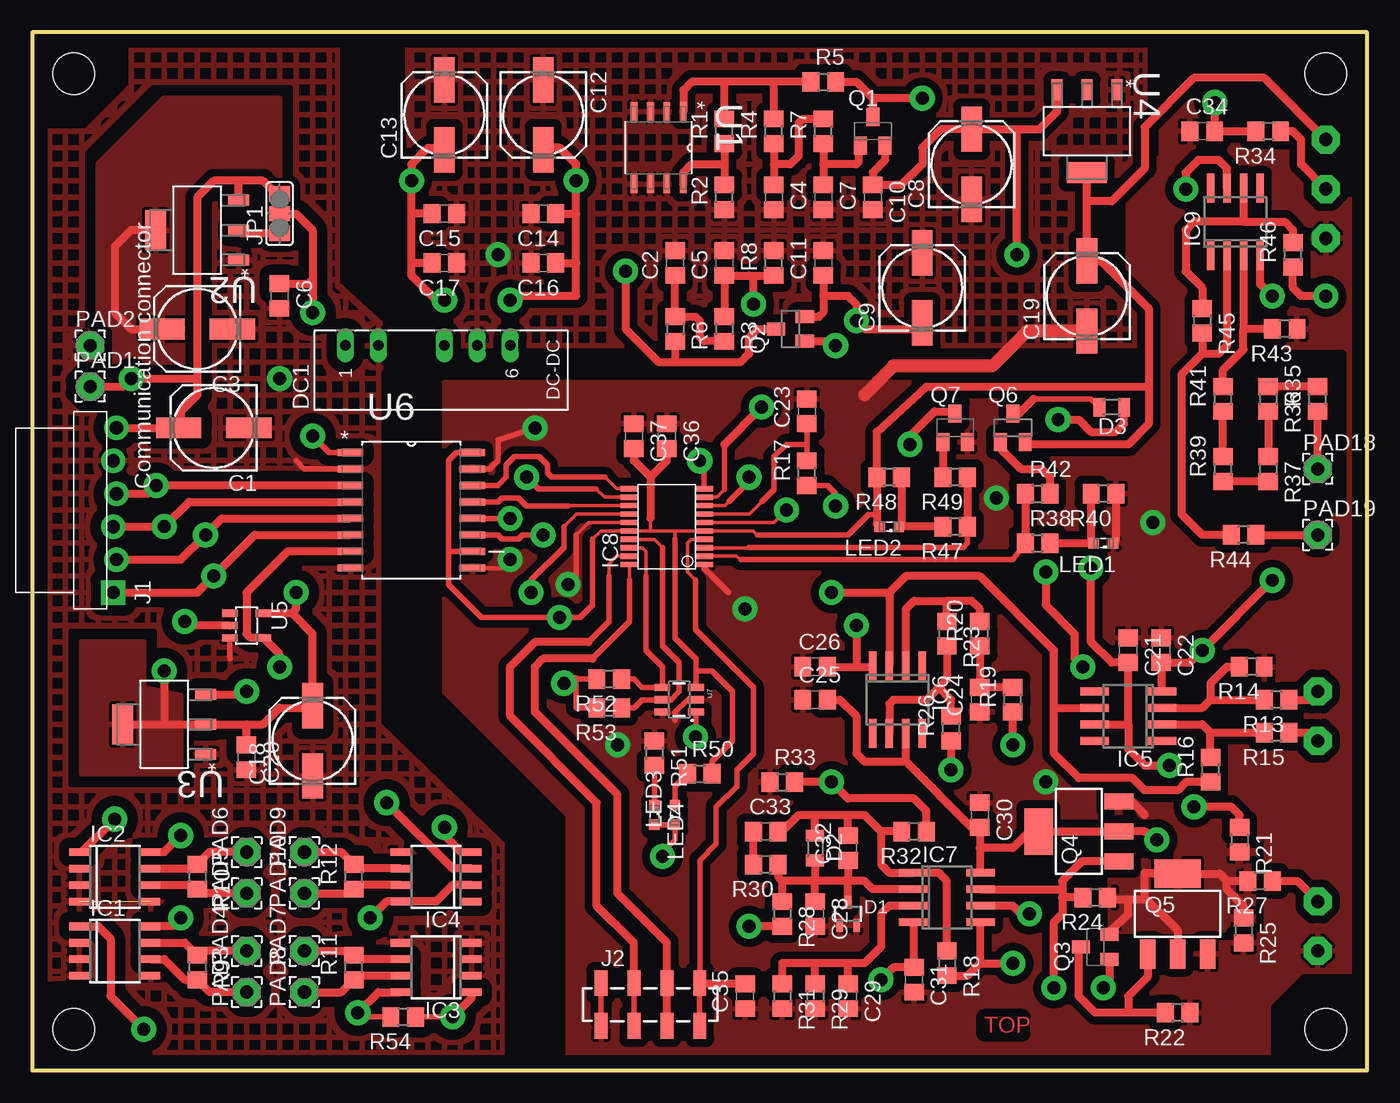
[diagram p4: board, top side]
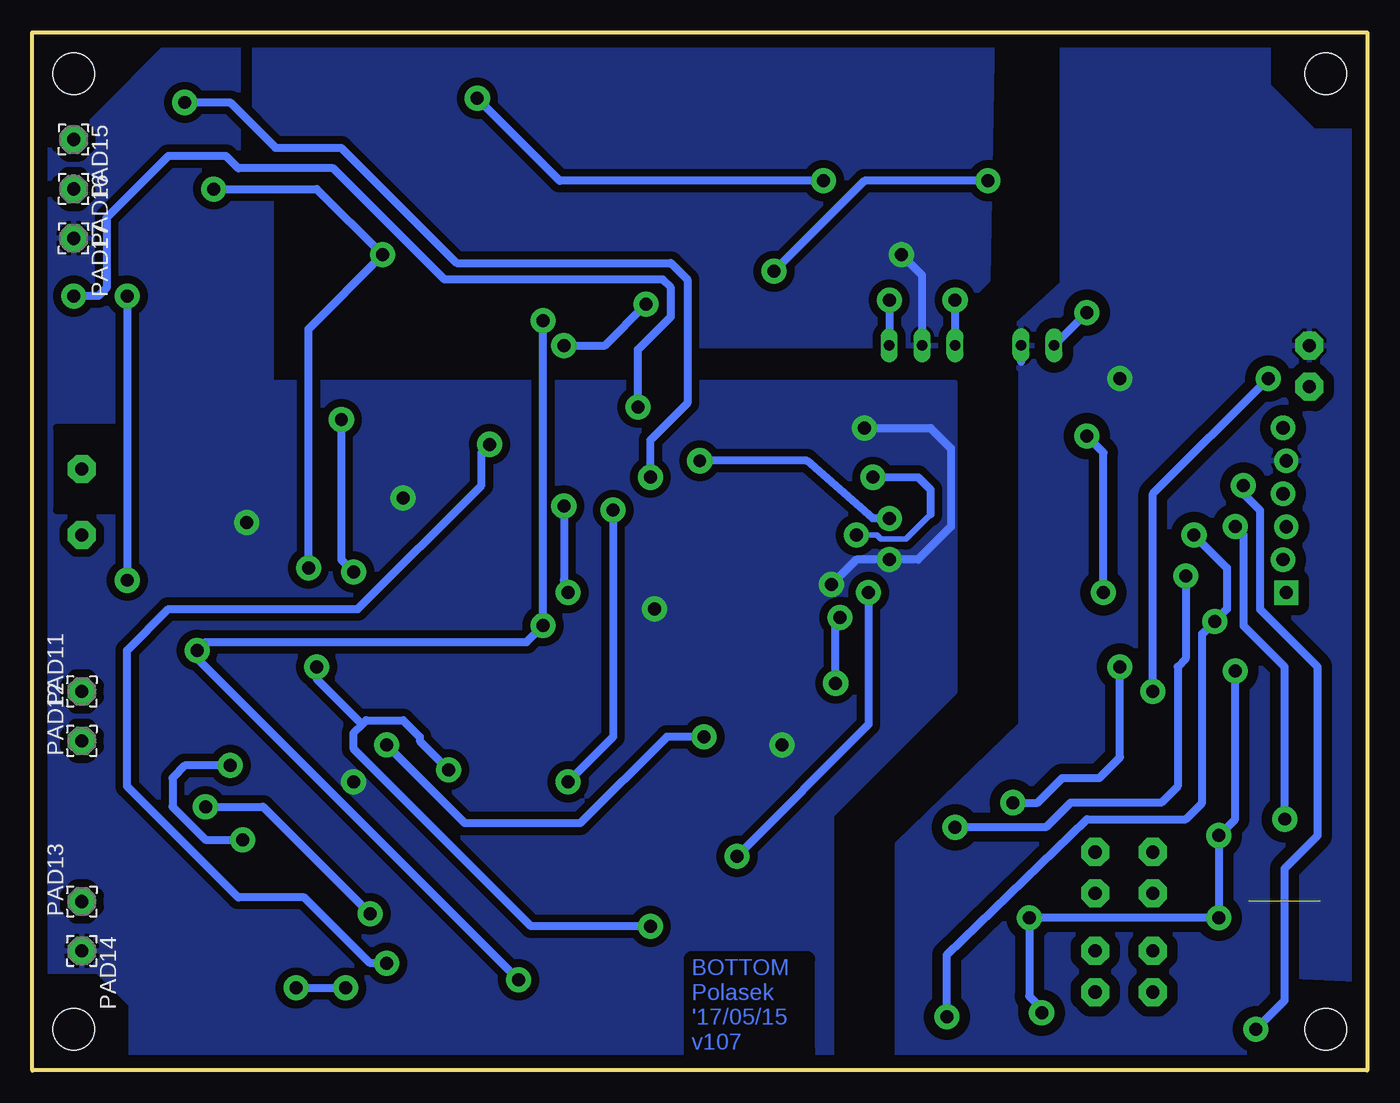
[diagram p5: board, bottom side, seen from below]

Size 102.87 x 80.01 mm. Coordinates in mm from the lower left corner, seen from the top.
Outline: 0,0 102.87,0 102.87,80.01 0,80.01 0,0
Copper layers (1*16): Top 0.035mm / dielectric 1.5mm / Bottom 0.035mm
Design rules "default *": minimum track width 10mil, minimum drill 24mil, track to track 8mil, track to pad 8mil, pad to pad 8mil, via to via 8mil, smd to smd 8mil, copper to edge 40mil, drill to drill 8mil, minimum pad ring 10mil, minimum via ring 8mil, stop-mask expansion 8mil, vias tented up to drill 0mil, thermal gap 10mil
Holes 3.2 mm at 3.18,76.83 3.18,3.17 99.7,3.17 99.7,76.83

### Footprints (pad centres in the part's own frame; a part is rotated, then mirrored left to right if it is on the bottom)
153CLV-0605 = smd 3.5 x 1.6: + 2.7,0; - -2.7,0
C0805 = smd 1.3 x 1.5: 1 -0.95,0; 2 0.95,0
SOT323 = smd 0.5 x 1: 1 -0.65,-0.9; 2 0.65,-0.9; 3 0,0.9
MICROMELF-W = smd 0.9 x 1.4: A 0.95,0; C -0.95,0
NMA = drill 0.813 long: 1 0,6.35; 2 0,3.81; 4 0,-1.27; 5 0,-3.81; 6 0,-6.35
D_R-PDSO-G8 = smd 0.6 x 1.5: 1 -1.905,-2.75; 2 -0.635,-2.75; 3 0.635,-2.75; 4 1.905,-2.75; 5 1.905,2.75; 6 0.635,2.75; 7 -0.635,2.75; 8 -1.905,2.75
SO08 = smd 0.6 x 2.2: 1 -1.905,-2.6; 2 -0.635,-2.6; 3 0.635,-2.6; 4 1.905,-2.6; 5 1.905,2.6; 6 0.635,2.6; 7 -0.635,2.6; 8 -1.905,2.6
TSSOP20-I = smd 0.4 x 1.35: 1 -2.925,-2.875; 2 -2.275,-2.875; 3 -1.625,-2.875; 4 -0.975,-2.875; 5 -0.325,-2.875; 6 0.325,-2.875; 7 0.975,-2.875; 8 1.625,-2.875; 9 2.275,-2.875; 10 2.925,-2.875; 11 2.925,2.875; 12 2.275,2.875; 13 1.625,2.875; 14 0.975,2.875; 15 0.325,2.875; 16 -0.325,2.875; 17 -0.975,2.875; 18 -1.625,2.875; 19 -2.275,2.875; 20 -2.925,2.875
MOLEX-1X6-RA_LOCK = drill 1.016 pad 1.88 square: 1 0,0.127 | drill 1.016 pad 1.88: 2 2.54,-0.127; 3 5.08,0.127; 4 7.62,-0.127; 5 10.16,0.127; 6 12.7,-0.127
1X04_SMD_STRAIGHT_COMBO = smd 1 x 2: 1 0,-1.65; 1-2 0,1.65; 2 2.54,1.65; 2-2 2.54,-1.65; 3 5.08,-1.65; 3-2 5.08,1.65; 4 7.62,1.65; 4-2 7.62,-1.65
PAD-JUMPER-3-NO_YES_SILK_FULL_BOX = smd 1.168 x 1.6: 1 -1.524,0; 2 0,0; 3 1.524,0
SML0603 = smd 0.8 x 0.8: A 0.75,0; C -0.75,0
2,15/1,0 = drill 1.016 pad 2.159 octagon: 1 0,0
SOT23-BEC = smd 1 x 1.4: B -0.95,-1.1; C 0,1.1; E 0.95,-1.1
SOT23 = smd 1 x 1.4: 1 -0.95,-1.1; 2 0.95,-1.1; 3 0,1.1
SOT223 = smd 1.219 x 2.235: 1 -2.311,-3.099; 2 0,-3.099; 3 2.311,-3.099 | smd 3.6 x 2.2: 4 0,3.099
R0805 = smd 1.3 x 1.5: 1 -0.95,0; 2 0.95,0
SOIC127P600X175-8N = smd 1.422 x 0.533: 1 -2.794,1.905; 2 -2.794,0.635; 3 -2.794,-0.635; 4 -2.794,-1.905; 5 2.794,-1.905; 6 2.794,-0.635; 7 2.794,0.635; 8 2.794,1.905
SOT230P696X180-4N = smd 1.6 x 0.838: 1 -3.2,2.311; 2 -3.2,0; 3 -3.2,-2.311 | smd 1.6 x 3.099: 4 3.2,0
SOT23-5L = smd 0.55 x 1.2: 1 -0.95,-1.3; 2 0,-1.3; 3 0.95,-1.3; 4 0.95,1.3; 5 -0.95,1.3
SOIC127P1032X265-16N = smd 1.981 x 0.533: 1 -4.699,4.445; 2 -4.699,3.175; 3 -4.699,1.905; 4 -4.699,0.635; 5 -4.699,-0.635; 6 -4.699,-1.905; 7 -4.699,-3.175; 8 -4.699,-4.445; 9 4.699,-4.445; 10 4.699,-3.175; 11 4.699,-1.905; 12 4.699,-0.635; 13 4.699,0.635; 14 4.699,1.905; 15 4.699,3.175; 16 4.699,4.445
SOT23-6 = smd 0.55 x 1.2: 1 0.95,1.3; 2 0,1.3; 3 -0.95,1.3; 4 -0.95,-1.3; 5 0,-1.3; 6 0.95,-1.3

### Placement (x,y rotation side)
C1  13.97,49.53 180 top
C2  49.53,62.23 90 top
C3  12.7,57.15 180 top
C4  57.15,67.31 270 top
C5  53.34,62.23 90 top
C6  19.05,59.69 270 top
C7  60.96,67.31 270 top
C8  72.39,69.85 90 top
C9  68.58,60.33 90 top
C10  64.77,67.31 270 top
C11  60.96,62.23 90 top
C12  39.37,73.66 270 top
C13  31.75,73.66 90 top
C14  39.37,66.04 180 top
C15  31.75,66.04 180 top
C16  39.37,62.23 180 top
C17  31.75,62.23 180 top
C18  21.59,25.4 90 top
C19  81.28,59.69 90 top
C20  16.51,24.13 270 top
C21  84.45,32.39 270 top
C22  87,32.39 270 top
C23  59.69,50.8 90 top
C24  73.03,28.58 90 top
C25  60.33,28.58 0 top
C26  60.33,31.11 0 top
C28  60.33,12.06 270 top
C29  62.87,5.72 270 top
C30  73.03,19.69 270 top
C31  67.94,6.98 270 top
C32  62.87,17.14 90 top
C33  56.52,18.42 0 top
C34  90.17,72.39 0 top
C35  54.93,5.72 90 top
C36  48.9,48.89 270 top
C37  46.36,48.89 270 top
D1  62.87,12.06 0 top
D2  60.33,17.14 270 top
D3  83.19,51.12 180 top
DC1  30.48,55.88 90 top
IC1  6.35,9.21 270 top
IC2  6.35,14.92 270 top
IC3  31.12,7.94 90 top
IC4  31.12,14.92 90 top
IC5  84.45,27.31 90 top
IC6  66.67,28.58 180 top
IC7  70.48,13.33 270 top
IC8  48.9,41.91 90 top
IC9  92.71,65.4 0 top
J1  6.35,36.83 90 top
J2  43.81,5.08 0 top
JP1  19.05,66.04 90 top
LED1  82.55,40.64 180 top
LED2  66.04,41.91 180 top
LED3  49.53,19.69 90 top
LED4  47.94,19.69 270 top
PAD1  4.45,52.7 0 top
PAD2  4.45,55.88 0 top
PAD3  16.51,6.03 90 top
PAD4  16.51,9.21 90 top
PAD5  16.51,13.65 90 top
PAD6  16.51,16.83 90 top
PAD7  20.95,9.21 90 top
PAD8  20.95,6.03 90 top
PAD9  20.95,16.83 90 top
PAD10  20.95,13.65 90 top
PAD11  99.06,29.21 90 bottom
PAD12  99.06,25.4 90 bottom
PAD13  99.06,13.02 90 bottom
PAD14  99.06,9.21 270 bottom
PAD15  99.7,71.76 270 bottom
PAD16  99.7,67.95 270 bottom
PAD17  99.7,64.14 270 bottom
PAD18  99.06,46.36 0 top
PAD19  99.06,41.28 0 top
Q1  64.77,72.39 0 top
Q2  58.42,57.15 90 top
Q3  81.92,9.53 90 top
Q4  80.64,18.42 90 top
Q5  88.27,12.06 0 top
Q6  75.56,49.53 0 top
Q7  71.12,49.53 0 top
R1  53.34,72.39 90 top
R2  53.34,67.31 90 top
R3  53.34,57.15 270 top
R4  57.15,72.39 90 top
R5  60.96,76.2 0 top
R6  49.53,57.15 270 top
R7  60.96,72.39 90 top
R8  57.15,62.23 90 top
R9  12.7,7.94 270 top
R10  12.7,14.92 270 top
R11  24.77,7.94 90 top
R12  24.77,14.92 90 top
R13  95.89,28.58 180 top
R14  93.98,31.11 180 top
R15  95.89,26.03 180 top
R16  90.81,23.18 90 top
R17  59.69,46.04 90 top
R18  70.48,8.25 270 top
R19  75.56,28.58 90 top
R20  73.03,33.66 90 top
R21  93.03,17.78 270 top
R22  88.27,4.45 180 top
R23  70.48,33.66 270 top
R24  81.92,13.33 180 top
R25  93.34,10.8 270 top
R26  70.8,26.35 90 top
R27  94.61,14.61 180 top
R28  57.79,12.06 270 top
R29  60.33,5.72 270 top
R30  56.52,15.88 180 top
R31  57.79,5.72 270 top
R32  67.94,18.42 180 top
R33  57.79,22.22 0 top
R34  95.25,72.39 180 top
R35  99.06,51.75 90 top
R36  95.25,51.75 270 top
R37  95.25,46.36 270 top
R38  77.47,40.64 0 top
R39  91.76,46.36 90 top
R40  82.55,44.45 180 top
R41  91.76,51.75 90 top
R42  77.47,44.45 0 top
R43  96.52,57.15 180 top
R44  93.34,41.28 180 top
R45  90.17,57.79 270 top
R46  97.16,62.86 90 top
R47  71.12,41.91 180 top
R48  66.04,45.72 180 top
R49  71.12,45.72 180 top
R50  51.44,22.86 0 top
R51  47.94,24.45 270 top
R52  44.45,30.16 180 top
R53  44.45,27.94 180 top
R54  28.57,4.13 180 top
U1  48.26,71.12 270 top
U2  12.7,64.77 180 top
U3  10.16,26.67 180 top
U4  81.28,72.39 270 top
U5  16.51,34.29 270 top
U6  29.21,43.18 0 top
U7  49.85,28.58 270 top

### Tracks (layer width: path | path; a pad name or v marks a point on that pad's centre or on a via)
+3V3  (via drill 1 pad 1.93)
  Top 0.254: 47.62,41.58 IC8.16 43.81,41.58 43.18,40.96 | 47.62,41.58 49.53,41.58 | 49.53,41.58 IC8.5 55.55,41.58 55.88,41.28 | 47.62,42.55 47.62,41.58 | 49.53,40.96 49.53,41.58
  Top 0.305: IC8.16
  Top 0.406: U6.10 32.07,40 | 32.07,40 32.07,46.99 32.7,47.63 U6.16 | 43.18,40.96 43.18,35.88 42.23,34.92 41.27,34.92 | v40.64,34.92 34.61,34.92 32.07,37.47 32.07,40 | R52.2 41.91,30.16 41.91,27.94 R53.2 | U7.3 51.15,30.8 | 51.15,30.8 51.15,31.72 49.53,33.34 49.53,40.96 | 55.88,41.28 62.87,41.28 64.45,42.86 65.09,42.86 | R50.2 52.38,23.81 53.98,25.4 53.98,29.21 52.39,30.8 51.15,30.8
  Top 0.61: 81.28,66.99 C19.+ 82.39,62.39 86.04,58.74 86.04,52.7 | 81.28,66.99 U4.4 | LED2.A 65.09,42.11 65.09,42.86 R48.2 65.09,49.21 68.9,52.7 86.04,52.7 | 86.04,52.7 86.04,49.85 84.45,48.26 76.69,48.26 Q6.2 | PAD15.1 94.93,76.52 89.53,76.52 85.72,72.71 85.72,69.53 83.19,66.99 81.28,66.99 | C37.2 46.36,46.99 47.62,45.72 | 47.62,45.72 47.62,42.55 | 47.62,45.72 48.9,46.99 C36.2 | 41.91,30.16 41.27,29.84 v40.96,29.84 | v40.64,34.92 41.27,34.92
  Bottom 0.61: v40.96,29.84 40.96,34.61 v40.64,34.92
+5V_NONISO  (via drill 1 pad 1.93)
  Top 0.406: v21.59,48.89 22.86,47.63 U6.1 | R54.2 25.08,4.13 v25.08,4.45
  Top 0.61: 16.51,26.67 U3.2 10.16,26.67 | 16.51,26.67 17.78,26.67 19.05,27.94 21.43,27.94 C18.+ 21.59,33.65 20,35.24 | C20.1 16.51,26.67 | U5.5 20,35.24 | 20,35.24 20.32,35.56 v20.32,36.83 | IC2.8 10.16,16.83 v11.43,18.1 | v11.43,11.75 10.79,11.11 IC1.8 | v26.04,11.75 27.3,13.02 IC4.8 31.12,13.02 32.39,14.29 IC4.2 | v25.08,4.45 26.67,6.03 IC3.8 | v10.16,30.8 10.16,26.67 | U3.4 10.16,26.67
  Bottom 0.61: v20.32,36.83 20.32,47.63 v21.59,48.89 | v25.08,4.45 25.08,4.76 26.04,5.72 v26.04,11.75 v11.43,11.75 v11.43,18.1 10.16,19.37 v10.16,30.8
  pour Top (isolate 0.61): 8.57,33.02 8.57,29.53 11.43,28.89 11.43,22.86 3.81,22.86 3.81,33.02
+12V  (via drill 1 pad 1.93)
  Top 0.61: Q1.E 65.72,70.17 64.77,69.21 C10.1 66.99,68.26 68.58,69.85 68.58,71.12 70.01,72.55 C8.+ 75.88,72.55 | 75.88,72.55 77.63,72.55 78.97,73.89 U4.3 | IC5.7 84.45,26.67 | 84.45,26.67 C21.2 83.18,31.44 81.6,33.02 v81.6,38.73 | 73.03,17.14 C30.2 72.39,18.73 67.31,23.81 | 73.03,17.14 73.03,15.3 IC7.8 | 73.03,17.14 75.56,17.14 76.83,18.42 Q4.4 Q4.2 85.72,18.42 v86.68,17.78 | IC9.7 92.08,69.53 91.44,70.17 89.85,70.17 88.9,69.21 v88.9,67.95 | v75.88,62.86 75.88,72.55 | C25.2 62.23,28.58 63.5,27.31 63.5,24.45 64.13,23.81 67.31,23.81 | 67.31,23.81 IC6.7 | 84.45,26.67 84.45,24.77 85.72,23.5 v87.63,23.5
  Bottom 0.61: v88.9,67.95 80.96,67.95 v75.88,62.86 81.6,57.15 v81.6,38.73 | v87.63,23.5 91.12,23.5 92.08,22.54 92.08,20.32 89.53,17.78 v86.68,17.78
+12V_+15V_NONSTAB  (via drill 1 pad 1.93)
  Top 0.61: 41.91,62.23 41.91,59.69 37.15,59.69 v36.83,59.37 | 41.91,62.23 41.91,66.04 | 41.91,66.04 v41.91,68.58 41.91,69.85 40.64,71.12 39.53,71.12 C12.+ | C14.1 41.91,66.04 | C16.1 41.91,62.23 | R5.2 63.5,76.2 64.77,74.93 | 64.77,74.93 Q1.C | v68.58,74.93 64.77,74.93
  Bottom 0.61: v41.91,68.58 62.23,68.58 v68.58,74.93 | v36.83,59.37 DC1.6
+12V_NONISO  (via drill 1 pad 1.93)
  Top 0.61: J1.6 C1.+ | JP1.3 18.8,67.56 17.78,68.58 15.88,68.58 | 15.88,68.58 13.97,68.58 12.7,67.31 12.7,53.34 | 12.7,49.69 C1.+ | U2.3 15.9,68.55 15.88,68.58 | 12.7,53.34 12.7,52.07 11.43,50.8 11.43,49.69 C1.+ | U3.3 16.28,28.98 v16.51,29.21 | 12.7,53.34 v7.62,53.34 6.99,52.7 PAD1.1
  Bottom 0.61: v16.51,29.21 16.51,44.45 v7.62,53.34
-12V  (via drill 1 pad 1.93)
  Top 0.61: Q2.2 60.64,58.1 60.96,58.42 60.96,59.69 | C11.1 60.96,59.69 | 60.96,59.69 62.87,59.69 63.5,59.05 v63.5,57.79 64.13,57.15 68.42,57.15 C9.- | IC5.4 87,29.27 C22.2 89.22,31.44 v90.17,32.39 v95.57,37.78 | C26.2 63.5,31.11 | 63.5,31.11 64.71,31.11 IC6.4 | v63.5,34.29 63.5,31.11 | v65.41,6.98 66.36,7.94 C31.1 67.94,11.37 IC7.4 | IC9.4 94.61,60.64 v95.57,59.69
  Bottom 0.61: v63.5,57.79 v63.5,34.29 64.77,33.02 89.53,33.02 v90.17,32.39 90.17,31.75 v65.41,6.98 | v95.57,59.69 v95.57,37.78 95.57,37.47
-12V_-15V_NONSTAB  (via drill 1 pad 1.93)
  Top 0.61: 29.21,62.23 29.21,61.28 31.12,59.37 v31.75,59.37 | 29.21,62.23 29.21,66.04 | 30.48,71.12 31.59,71.12 C13.- 30.32,70.96 29.21,69.85 v29.21,68.58 29.21,66.04 | C15.2 29.21,66.04 | C17.2 29.21,62.23 | R6.2 49.53,54.61 | v45.72,61.6 45.72,57.15 48.26,54.61 49.53,54.61 | 49.53,54.61 54.61,54.61 55.24,55.24 55.24,56.52 55.88,57.15 Q2.3
  Bottom 0.61: v29.21,68.58 38.73,68.58 v45.72,61.6 | v31.75,59.37 DC1.4
/RST
  Top 0.254: IC8.4 50.78,40.94 50.48,40.64 50.48,38.42 51.12,37.78
  Top 0.406: J2.4 51.44,16.19 52.7,17.46 52.7,20.32 54.29,21.91 54.29,23.18 55.56,24.45 55.56,29.53 51.12,33.97 51.12,37.78
  Top 0.61: J2.4 54.86,6.73 C35.2
AN_OVERRIDE_1  (via drill 1 pad 1.93)
  Top 0.406: D3.C
  Top 0.61: R26.1 v70.8,23.18 | R28.2 v55.25,11.11 v55.24,11.11 | D3.C 84.14,49.85 83.5,49.21 81.6,49.21 80.64,50.17 v79.06,50.17 | v78.11,38.42 78.11,35.88 80.33,33.66 80.33,31.75 v80.96,31.11
  Bottom 0.61: v55.24,11.11 64.45,11.11 78.11,24.77 78.11,26.03 77.47,26.67 | 77.47,26.67 77.15,26.99 74.3,26.99 73.03,25.72 73.03,25.4 v70.8,23.18 | v79.06,50.17 79.06,39.37 v78.11,38.42 | v80.96,31.11 80.96,30.16 77.47,26.67
AN_OVERRIDE_2  (via drill 1 pad 1.93)
  Top 0.61: R18.2 72.08,7.31 73.03,8.25 | IC7.5 73.03,11.37 73.03,8.25 | 73.03,8.25 v75.56,8.25 | v67.63,48.26 67.63,48.89 69.53,50.8 70.95,50.8 Q7.C
  Bottom 0.61: v75.56,8.25 76.83,8.25 81.92,13.33 87,13.33 95.57,21.91 95.57,32.39 92.39,35.56 77.79,35.56 68.26,45.08 68.26,47.63 v67.63,48.26
GND  (via drill 1 pad 1.93)
  Top 0.254: IC8.15 42.87,42.23 41.91,41.28
  Top 0.305: 41.91,38.1 v41.27,37.47 | U6.9 36.2,38.73 v36.83,39.37
  Top 0.406: 41.91,41.28 41.91,38.1 | U6.15 35.24,46.36 35.88,46.99 35.88,48.58 v38.73,49.53 | IC8.1 51.77,38.72 53.66,36.83 | U7.2 50.48,28.58 49.53,27.62 49.53,26.99
  Top 0.61: R40.1 83.5,40.84 LED1.C | v35.88,62.86 36.2,62.86
  Top 1.016: C19.- 76.67,56.99 73.98,54.29 66.36,54.29 64.13,52.07
  Bottom 0.61: v41.27,37.47 39.37,39.37 v36.83,39.37 34.61,39.37 32.07,41.91 32.07,47.94 33.66,49.53 v38.73,49.53 | DC1.5 34.29,61.28 v35.88,62.86
  other vias: 86.36,42.23 74.3,44.13 54.93,35.56 45.09,25.08 78.11,22.22
  pour Top (isolate 0.61, hatched): 85.72,55.88 31.75,55.88 31.75,58.42 29.21,60.96 28.89,80.01 85.72,80.01
  pour Top (isolate 0.61, rank 2): 31.75,53.02 31.75,29.21 41.27,19.69 41.27,0 95.25,0 95.25,5.08 97.79,7.62 102.87,7.62 102.87,80.01 87,80.01 87,70.48 84.45,67.95 84.45,53.02
  pour Bottom (isolate 0.61, rank 2): 31.75,53.02 31.75,29.21 41.27,19.69 41.27,0 95.25,0 95.25,5.08 97.79,7.62 102.87,7.62 102.87,72.71 98.74,72.71 91.44,80.01 87,80.01 87,70.48 84.45,67.95 84.45,53.02
  pour Bottom (isolate 0.61): 85.72,55.88 31.75,55.88 31.75,58.42 29.21,60.96 28.89,80.01 85.72,80.01
  cutout Top (isolate 0.61): 100.97,55.24 100.97,43.18 90.17,43.18 90.17,55.24
  cutout Bottom (isolate 0.61): 100.97,49.53 100.97,43.18 96.84,43.18 96.84,49.53
GND_NONISO  (via drill 1 pad 1.93)  (1 unrouted)
  Top 0.406: U5.3 15.21,31.78 15.24,31.75 | U6.2 20.95,46.36 20.32,46.99
  Bottom 0.61: DC1.2 26.67,54.61
  other vias: 19.05,53.34
  pour Top (isolate 0.813, rank 2, hatched): 0,6.98 0,72.39 4.13,72.39 7.62,75.88 7.62,80.01 23.5,80.01 23.5,60.64 26.99,57.47 26.99,54.29 26.67,53.98 26.67,26.67 36.2,17.46 36.2,0 7.94,0 7.94,5.72 6.67,7.3
  pour Bottom (isolate 0.813, rank 2): 0,6.98 0,72.39 4.13,72.39 7.62,75.88 7.62,80.01 23.5,80.01 23.5,60.64 26.99,57.47 26.99,54.29 26.67,53.98 26.67,26.67 36.2,17.46 36.2,0 7.94,0 7.94,5.72 6.67,7.3
I2C_SCL
  Top 0.254: IC8.17 47.97,40.94 48.58,40.32
  Top 0.406: 48.58,40.32 48.58,32.7 49.85,31.43 49.85,29.21 49.21,28.58 U7.5 46.99,28.58 46.36,27.94 R53.1
I2C_SDA
  Top 0.254: IC8.18 47.03,40.28 47.31,40 47.31,38.1
  Top 0.305: 48.58,29.56 U7.4
  Top 0.406: 48.58,29.56 48.58,31.11 47.31,32.39 47.31,38.1 | R52.1 46.36,30.16 46.99,29.53 U7.4
INDICATION  (via drill 1 pad 1.93)
  Top 0.254: IC8.14 41.93,42.89 40.96,41.91
  Top 0.406: 40.96,41.91 40.96,40.32 38.42,37.78 v38.42,36.83 | LED4.A LED3.C 49.53,17.78 48.58,16.83 v48.58,16.51
  Bottom 0.61: v38.42,36.83 38.42,34.29 38.42,26.67 v48.58,16.51
INTEGRAL
  Top 0.61: C33.2 57.79,18.42 59.05,19.69 60.33,19.69 | 60.33,19.69 62.87,19.69 | 62.87,19.69 64.13,19.69 65.41,18.42 | 65.41,18.42 65.41,15.88 66.04,15.24 IC7.1 69.85,15.24 70.48,14.61 R18.1 | R32.2 65.41,18.42 | C32.2 62.87,19.69 | D2.C 60.33,19.69
ISO_SPI_MISO  (via drill 1 pad 1.93)
  Top 0.61: J1.1 12.7,36.83 v13.97,38.1 17.15,41.28 U6.6 | v31.75,18.73 31.75,18.1 33.02,16.83 IC4.4
  Bottom 0.61: v13.97,38.1 13.97,31.75 14.61,31.11 14.61,21.91 15.88,20.64 22.86,20.64 24.77,18.73 v31.75,18.73
ISO_SPI_MOSI  (via drill 1 pad 1.93)
  Top 0.61: J1.3 v10.16,41.91 12.07,43.82 U6.4 | IC2.1 3.81,16.83 v6.35,19.37
  Bottom 0.61: v10.16,41.91 9.53,41.28 9.53,34.29 6.35,31.11 v6.35,19.37
ISO_SPI_NSS  (via drill 1 pad 1.93)
  Top 0.406: R54.1 v32.39,4.13
  Top 0.61: J1.2 11.43,39.37 v13.34,41.28 14.61,42.55 U6.5 | IC3.1 33.87,5.61 v32.39,4.13 | U5.2 12.07,34.29 v11.75,34.61
  Bottom 0.61: v13.34,41.28 10.79,38.73 10.79,35.56 v11.75,34.61 12.7,33.66 12.7,20.64 13.97,19.37 21.59,19.37 32.39,8.89 v32.39,4.13
ISO_SPI_SCK  (via drill 1 pad 1.93)
  Top 0.61: U6.3 v9.53,45.08 8.89,44.45 J1.4 | IC1.1 5.08,11.11 6.03,10.16 6.03,5.72 v8.57,3.17
  Bottom 0.61: v9.53,45.08 9.53,44.45 8.26,43.18 8.26,35.56 3.81,31.11 3.81,18.1 6.35,15.56 6.35,5.4 v8.57,3.17
N$1
  Top 0.61: R38.2 LED1.A 81.6,40.84 R40.2
N$2
  Top 0.61: R30.2 C33.1
N$3
  Top 0.61: R13.1 99.06,28.58 PAD11.1
N$4
  Top 0.61: Q6.1 74.61,47.94 76.2,46.36 77.79,46.36 78.42,45.72 R42.2
N$5
  Top 0.61: R27.1 97.47,14.61 PAD13.1
N$6
  Top 0.61: 93.34,14.28 R27.2 92.08,14.61 | 92.08,14.61 91.52,15.16 Q5.4 88.19,15.24 85.72,15.24 85.72,13.33 85.58,13.19 | R25.1 93.34,12.7 92.08,13.97 92.08,14.61 | R24.1 83.02,13.19 84.45,13.19 | 84.45,13.19 85.58,13.19 | 85.58,13.19 85.88,13.19 88.27,10.8 Q5.2 | Q3.E 83.02,10.62 84.45,12.06 84.45,13.19 | Q4.3 84.68,20.73 85.72,19.69
  pour Top (isolate 0.61): 93.98,10.8 83.19,10.8 83.19,20.95 93.98,20.95
N$7
  Top 0.61: Q7.B R49.2
N$8  (via drill 1 pad 1.93)
  Top 0.61: Q3.B 83.02,6.81 v82.55,6.35 | v78.74,6.35 78.74,11.43 79.38,12.06 79.38,13.33 | R24.2 79.38,13.33 | Q4.1 80.87,16.1 79.38,14.61 79.38,13.97 | 79.38,13.97 79.38,13.33 | IC7.7 79.38,13.97
  Bottom 0.61: v82.55,6.35 v78.74,6.35
N$9
  Top 0.406: 77.15,51.75 81.6,51.75 D3.A
  Top 0.61: Q6.3 76.03,50.63 77.15,51.75
N$10
  Top 0.61: IC5.3 90.17,27.94 90.81,28.58 | 90.81,28.58 R13.2 | R14.2 92.08,31.11 90.81,29.84 90.81,28.58
N$11
  Top 0.61: R15.1 99.06,26.03 PAD12.1
N$12
  Top 0.61: IC5.2 90.17,26.67 90.81,26.03 | 90.81,26.03 R15.2 | R16.2 90.81,26.03
N$13
  Top 0.61: R48.1 66.99,42.11 LED2.C R47.2
N$14
  Top 0.61: IC7.2 64.77,13.97 64.13,14.61 62.87,14.61 | 62.87,14.61 60.33,14.61 | 60.33,14.61 57.79,14.61 | 57.79,14.61 R28.1 | R30.1 57.47,14.92 57.79,14.61 | C28.1 60.33,14.61 | D2.A 60.33,14.61 | C32.1 62.87,14.61 | D1.3 62.87,14.61
N$15
  Top 0.61: C29.1 62.87,8.25 | 62.87,8.25 60.33,8.25 | 60.33,8.25 57.79,8.25 R31.1 | R29.1 60.33,8.25 | IC7.3 66.04,12.7 65.41,12.06 65.41,9.53 64.13,8.25 62.87,8.25
N$16
  Top 0.61: R23.2 70.48,30.16 69.85,29.53 | 69.85,29.53 68.9,28.58 66.36,28.58 66.04,28.26 IC6.6 | R26.2 70.8,28.58 69.85,29.53
N$17
  Top 0.61: R22.2 84.45,4.45 | 84.45,4.45 81.92,4.45 80.64,5.72 80.64,9.36 Q3.C | Q5.1 85.95,7.21 84.45,5.72 84.45,4.45
N$18  (via drill 1 pad 1.93)
  Top 0.61: R21.1 93.03,19.69 92.39,20.32 v89.53,20.32 | v76.83,12.06 76.2,12.06 75.56,12.7 IC7.6
  Bottom 0.61: v89.53,20.32 85.09,20.32 v76.83,12.06
N$19
  Top 0.61: R23.1 70.48,36.2 | IC6.2 67.31,35.56 67.94,36.2 70.48,36.2 | R20.2 73.03,35.56 72.39,36.2 70.48,36.2
N$20
  Top 0.61: PAD16.1 97.79,69.85 97.79,71.76 97.16,72.39 R34.1
N$21
  Top 0.61: R4.1 57.15,69.85 | 57.15,69.85 C4.1 | R7.2 59.37,73.34 59.05,73.02 59.05,70.48 58.42,69.85 57.15,69.85
N$22
  Top 0.61: IC9.3 93.34,57.15 | R43.2 93.34,57.15 | R41.2 91.76,53.98 93.34,55.56 93.34,57.15
N$23
  Top 0.406: LED3.A 49.53,21.91 R50.1
N$24
  Top 0.61: IC9.2 92.08,55.88 91.44,55.24 90.17,55.24 | R45.2 90.17,55.24 | R44.2 90.17,41.28 88.58,42.86 88.58,53.66 90.17,55.24
N$25
  Top 0.61: PAD9.1 23.81,16.83 R12.2 25.08,15.56 IC4.6
N$26  (via drill 1 pad 1.93)
  Top 0.61: JP1.2 20.32,66.04 21.59,64.77 21.59,60.96 | 21.59,60.96 v21.59,58.42 | C6.1 21.27,60.64 21.59,60.96
  Bottom 0.61: v21.59,58.42 DC1.1
N$27
  Top 0.61: R1.1 53.34,69.85 | 53.34,69.85 R2.2 | U1.8 50.16,69.21 50.8,69.85 53.34,69.85
N$28
  Top 0.61: R5.1 57.15,76.2 | 57.15,76.2 53.34,76.2 | 53.34,76.2 50.8,76.2 50.16,75.57 U1.1 | R1.2 53.34,76.2 | R4.2 57.15,76.2
N$29
  Top 0.61: R7.1 60.96,69.85 | 60.96,69.85 C7.1 | Q1.B 63.67,71.29 63.67,70.02 63.5,69.85 60.96,69.85
N$30
  Top 0.61: C2.1 R6.1 51.12,58.1 51.44,57.79 51.44,56.52 51.75,56.2 R3.2
N$31  (via drill 1 pad 1.93)
  Top 0.61: R3.1 C5.1 55.24,61.28 | 55.24,61.28 R8.1 | Q2.1 61.59,56.2 v61.91,55.88 | v55.56,59.05 55.56,60.96 55.24,61.28
  Bottom 0.61: v61.91,55.88 58.74,55.88 v55.56,59.05
N$32
  Top 0.61: IC9.6 93.34,65.4 | 93.34,65.4 89.53,65.4 88.9,64.77 88.9,61.6 90.17,60.33 R45.1 | 93.34,65.4 96.52,65.4 97.16,64.77 R46.2
N$33
  Top 0.61: R39.2 R41.1
N$34
  Top 0.61: R37.2 R39.1
N$35
  Top 0.61: R36.2 R37.1
N$36
  Top 0.61: R35.2 R36.1
N$37
  Top 0.61: R44.1 PAD19.1
N$38
  Top 0.61: PAD18.1 R35.1
N$39
  Top 0.61: PAD10.1 24.45,13.65 R12.1 25.08,14.29 IC4.7
N$40
  Top 0.61: PAD7.1 24.45,9.21 R11.2 25.08,8.57 IC3.6
N$41
  Top 0.61: PAD8.1 23.81,6.03 R11.1 25.08,7.3 IC3.7
N$42
  Top 0.61: IC2.6 12.39,14.29 R10.2 13.02,13.65 PAD5.1
N$43
  Top 0.61: IC2.7 12.39,15.56 R10.1 13.66,16.83 PAD6.1
N$44
  Top 0.61: IC1.7 11.75,9.84 R9.1 13.02,9.21 PAD4.1
N$45
  Top 0.61: JP1.1 16.15,64.52 U2.2
N$46
  Top 0.61: IC1.6 10.16,8.57 11.43,7.3 11.75,6.99 R9.2 13.66,6.03 PAD3.1
N$47
  Top 0.61: U2.4 7.62,64.77 6.35,63.5 6.35,58.42 7.62,57.15 C3.+
  pour Top (isolate 0.61): 12.7,54.61 12.7,68.58 19.05,68.58 19.05,74.93 10.16,74.93 5.08,69.85 5.08,58.42 6.35,57.15 6.35,54.61
N$48
  Top 0.406: R51.2 LED4.C
N$73  (via drill 1 pad 1.93)
  Top 0.406: R17.1 61.27,45.09 61.91,44.45 v61.91,43.5
  Top 0.61: R16.1 88.9,22.22 88.27,21.59 85.72,21.59 84.77,22.54 80.64,22.54 78.74,24.45 78.74,27.94 | 78.74,27.94 IC5.6 | 78.74,27.94 78.74,32.39 73.03,38.1 67.31,38.1 66.04,36.83 | 66.04,36.83 IC6.3 | v61.59,36.83 66.04,36.83
  Bottom 0.61: v61.91,43.5 61.91,37.78 v61.59,36.83
N$75
  Top 0.61: R20.1 C24.2 R19.2
OVR1
  Top 0.254: IC8.2 54.24,39.64 54.61,39.37
  Top 0.406: 54.61,39.37 75.57,39.37 R38.1
  Top 0.61: R42.1 R38.1
OVR2
  Top 0.254: IC8.3 55.21,40.28 55.24,40.32
  Top 0.406: 55.24,40.32 71.75,40.32 72.07,40.64 R47.1
  Top 0.61: R49.1 R47.1
READ_I
  Top 0.254: IC8.7 55.27,42.89 56.22,43.84
  Top 0.406: 56.22,43.84 57.15,44.77 57.15,47.31 58.1,48.26 59.69,48.26 | C23.1 59.69,48.26 | 59.69,48.26 R17.2
READ_INTEGRAL  (via drill 1 pad 1.93)
  Top 0.254: IC8.6 57.16,42.23 v58.1,43.18
  Top 0.61: R33.2 v61.59,22.22 62.87,20.95 67.94,20.95 68.9,20 R32.1
  Bottom 0.61: v58.1,43.18 58.1,25.72 v61.59,22.22
READ_U  (via drill 1 pad 1.93)
  Top 0.254: IC8.9 52.76,44.18 53.34,44.77
  Top 0.406: 53.34,44.77 53.34,48.26
  Top 0.61: 53.34,48.26 v56.2,51.12 | v99.7,59.69 97.79,59.69 97.16,60.33 R46.1
  Bottom 0.61: v56.2,51.12 56.2,55.56 53.66,58.1 53.66,60.33 54.29,60.96 71.12,60.96 79.69,69.53 87,69.53 87.95,70.48 92.39,70.48 97.16,65.72 97.16,60.33 97.79,59.69 v99.7,59.69
SET_I  (via drill 1 pad 1.93)
  Top 0.406: U7.1 51.15,26.38 v51.12,25.72
  Top 0.61: v75.56,25.08 R19.1
  Bottom 0.61: v51.12,25.72 53.98,25.72 60.64,19.05 69.53,19.05 v75.56,25.08
SPI_MISO  (via drill 1 pad 1.93)
  Top 0.254: IC8.12 44.08,44.18 43.45,44.82
  Top 0.406: v38.1,45.72 39,44.82 43.45,44.82 | v39.37,41.28 37.78,41.28 37.47,40.96 36.2,40.96 35.88,41.28 U6.11
  Bottom 0.406: 33.66,42.86 35.56,40.96 37.47,40.96 37.78,41.28 v39.37,41.28
  Bottom 0.61: v38.1,45.72 34.61,45.72 33.66,44.77 33.66,42.86
SPI_MOSI
  Top 0.254: IC8.13 41.31,43.54
  Top 0.305: 41.31,43.54 41.27,43.5
  Top 0.406: U6.13 35.88,43.82 36.2,44.13 37.47,44.13 38.1,43.5 41.27,43.5
SPI_NSS  (via drill 1 pad 1.93)
  Top 0.406: U6.12 v36.83,42.55 | IC8.10 51.77,46.65 v51.44,46.99
  Bottom 0.61: v36.83,42.55 38.1,42.55 43.18,46.99 v51.44,46.99
SPI_SCK
  Top 0.254: IC8.11 45.02,44.83 44.13,45.72
  Top 0.406: U6.14 35.88,45.08 36.51,45.72 36.51,46.67 37.15,47.31 39.05,47.31 39.69,46.67 39.69,46.04 40,45.72 44.13,45.72
SS  (via drill 1 pad 1.93)
  Top 0.61: U6.7 19.69,40 16.51,36.83 16.51,33.66 16.82,33.34 U5.4 19.05,32.1 v19.05,31.11 | IC4.3 32.39,15.56 v27.3,20.64
  Bottom 0.61: v27.3,20.64 25.4,20.64 23.5,22.54 20.64,22.54 19.05,24.13 v19.05,31.11
SWCLK
  Top 0.254: IC8.20 46.02,37.8 46.04,37.78
  Top 0.406: 46.04,37.78 46.04,34.61 43.18,31.75
  Top 0.61: 43.18,31.75 39.37,31.75 38.73,31.11 38.73,27.62 45.09,21.27 45.09,13.65 48.9,9.84 J2.3
SWDIO
  Top 0.254: IC8.19 45.03,39.64 44.45,39.05 44.45,38.1
  Top 0.406: 44.45,38.1 44.45,34.61 42.86,33.02
  Top 0.61: 42.86,33.02 38.73,33.02 36.83,31.11 36.83,27.31 43.5,20.64 43.5,12.7 46.36,9.84 J2.2
TEMPERATURE  (via drill 1 pad 1.93)
  Top 0.254: IC8.8 53.38,43.54 53.82,43.97
  Top 0.406: 53.7,43.85 53.82,43.97 55.24,45.4 v55.24,45.72
  Top 0.61: R34.2 C34.2 v91.12,74.61
  Bottom 0.61: v91.12,74.61 87.63,74.61 84.14,71.12 79.06,71.12 70.17,62.23 53.66,62.23 52.39,60.96 52.39,51.43 55.24,48.58 v55.24,45.72

### Text on the board
Top: TOP
Bottom: BOTTOM / Polasek / '17/05/15 / v107
tStop: tStop
bStop: bStop